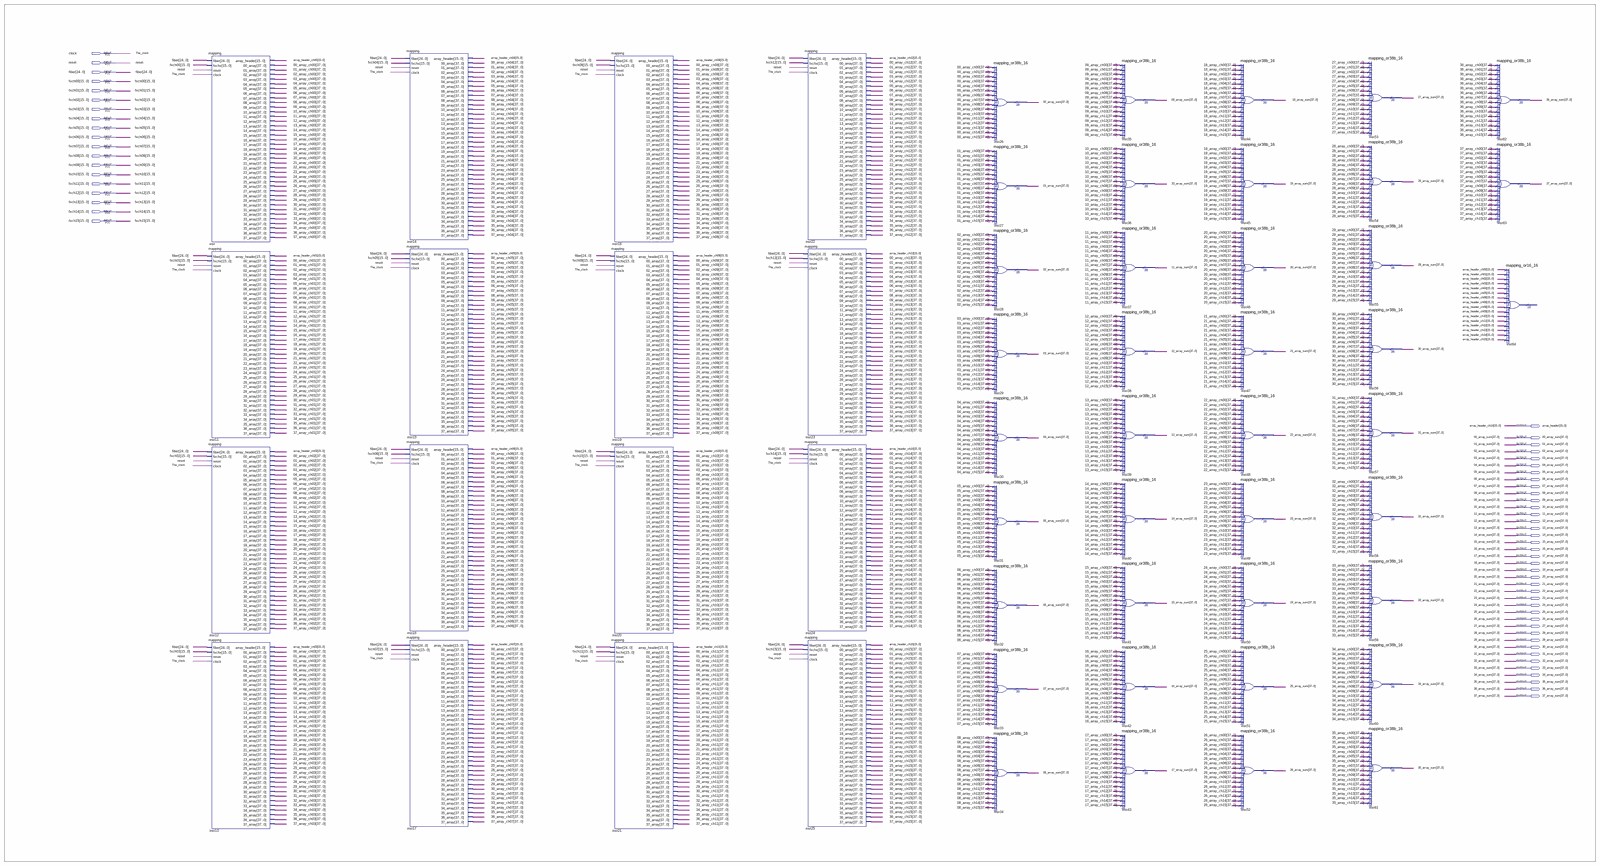
[diagram p0: schematic sheet, whole]
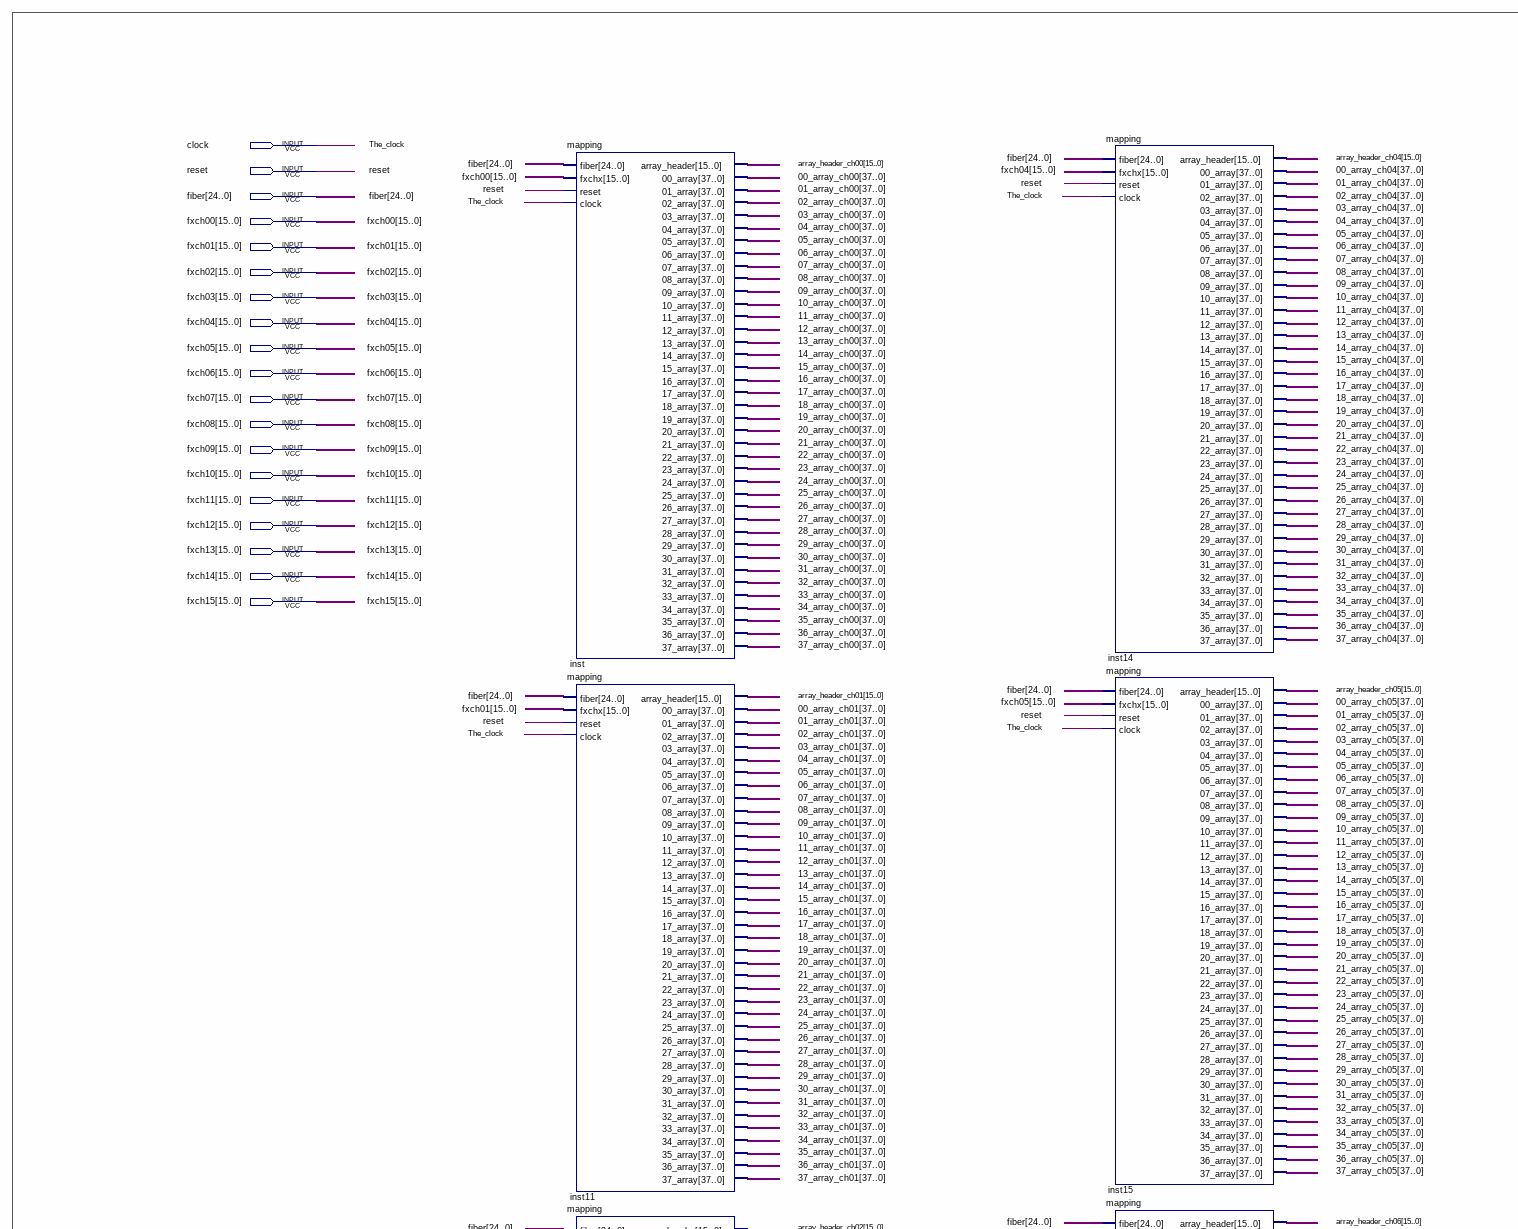
[diagram p1: schematic sheet, upper left part]
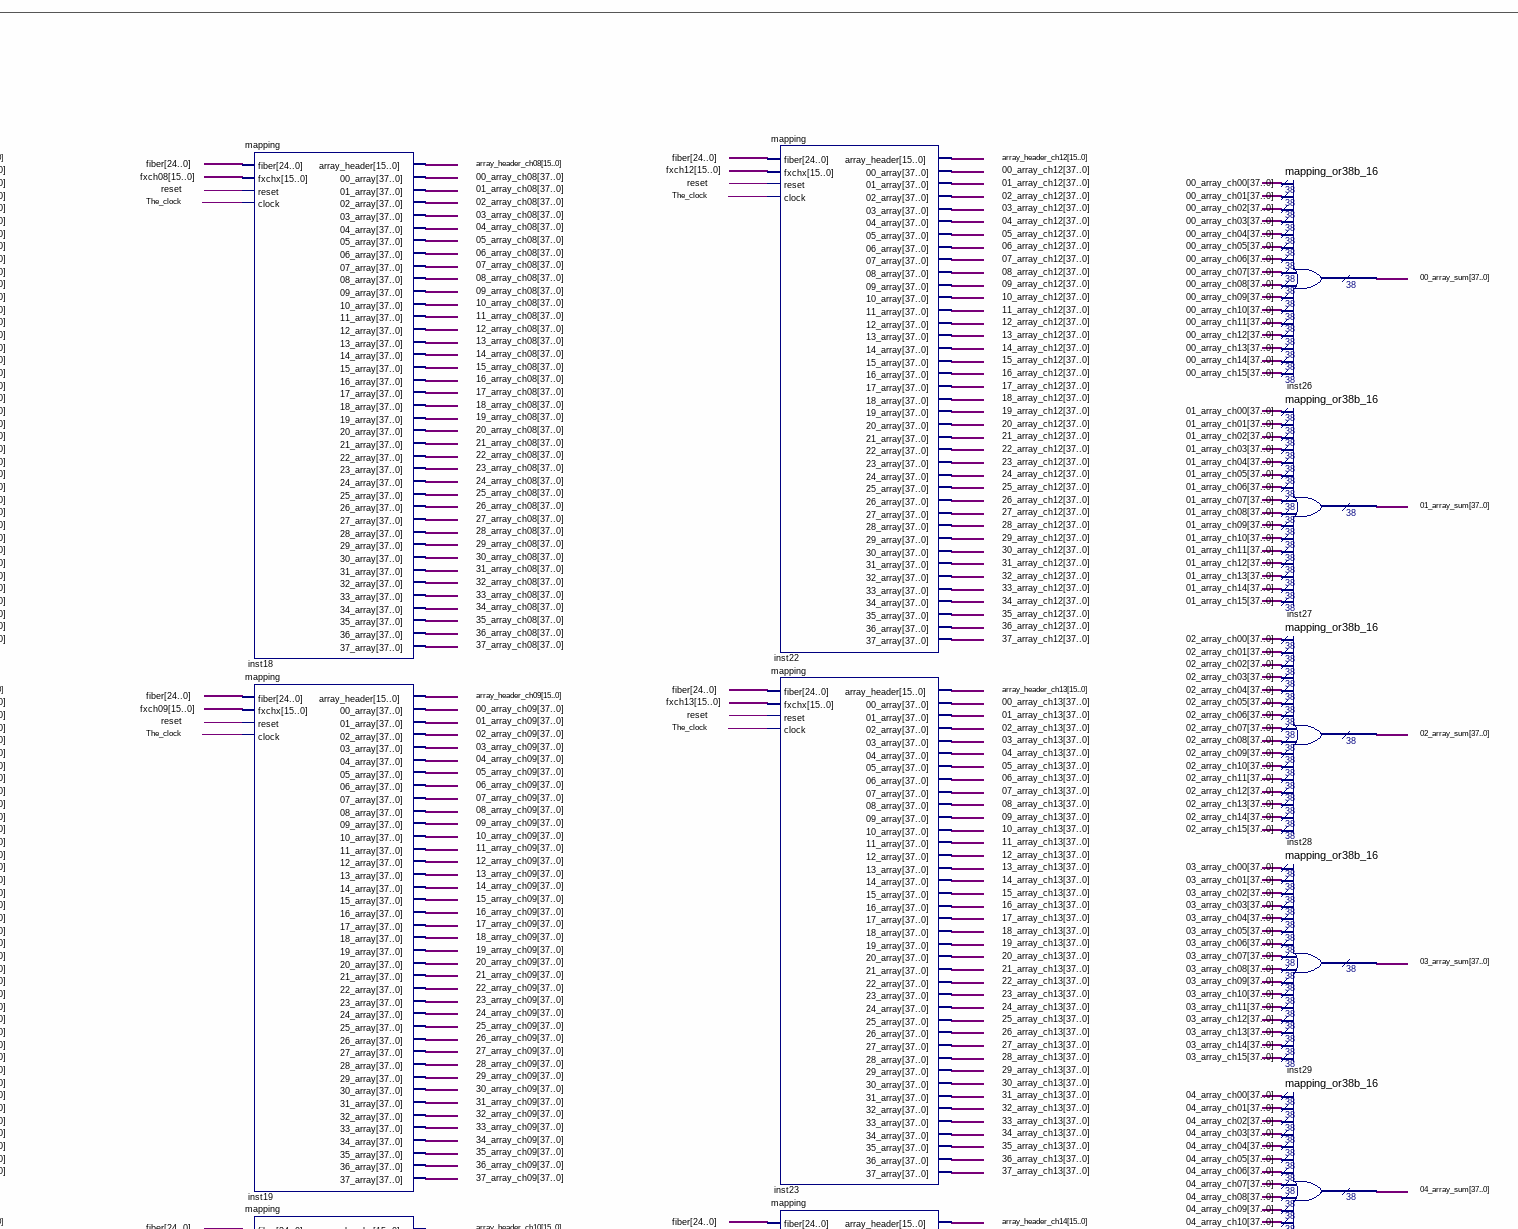
[diagram p2: schematic sheet, upper centre part]
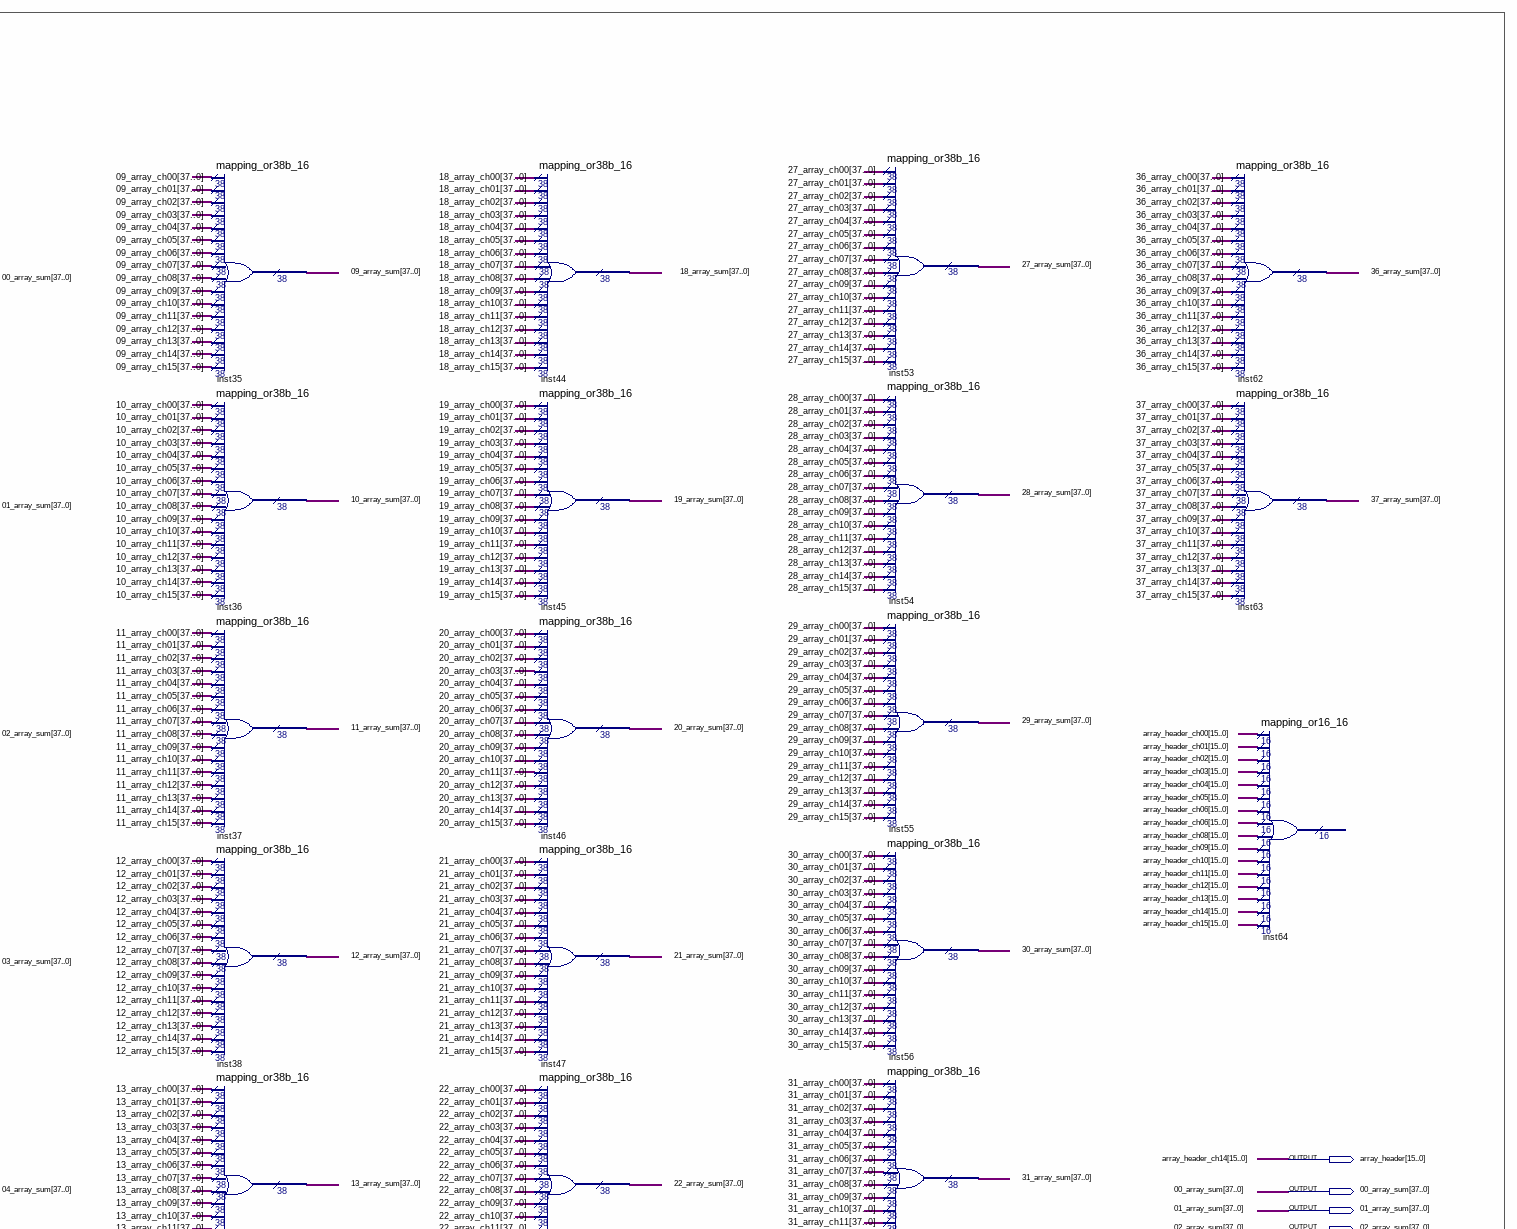
[diagram p3: schematic sheet, upper right part]
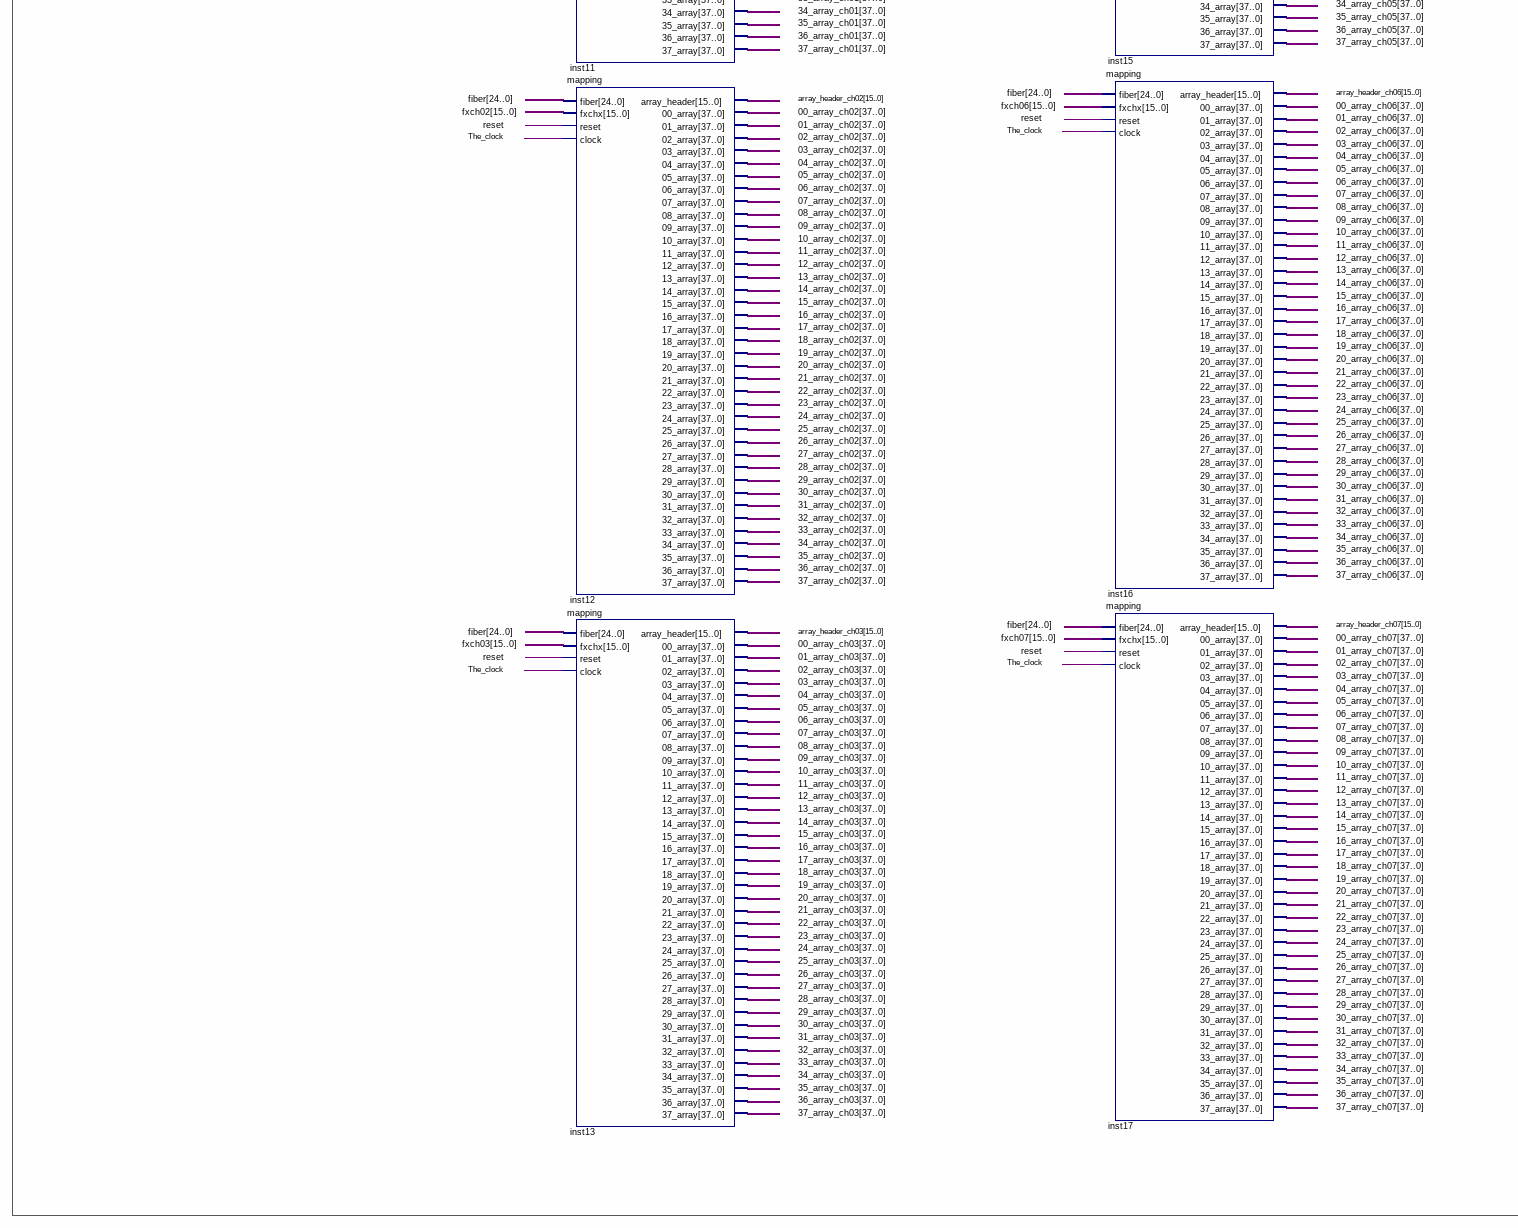
[diagram p4: schematic sheet, lower left part]
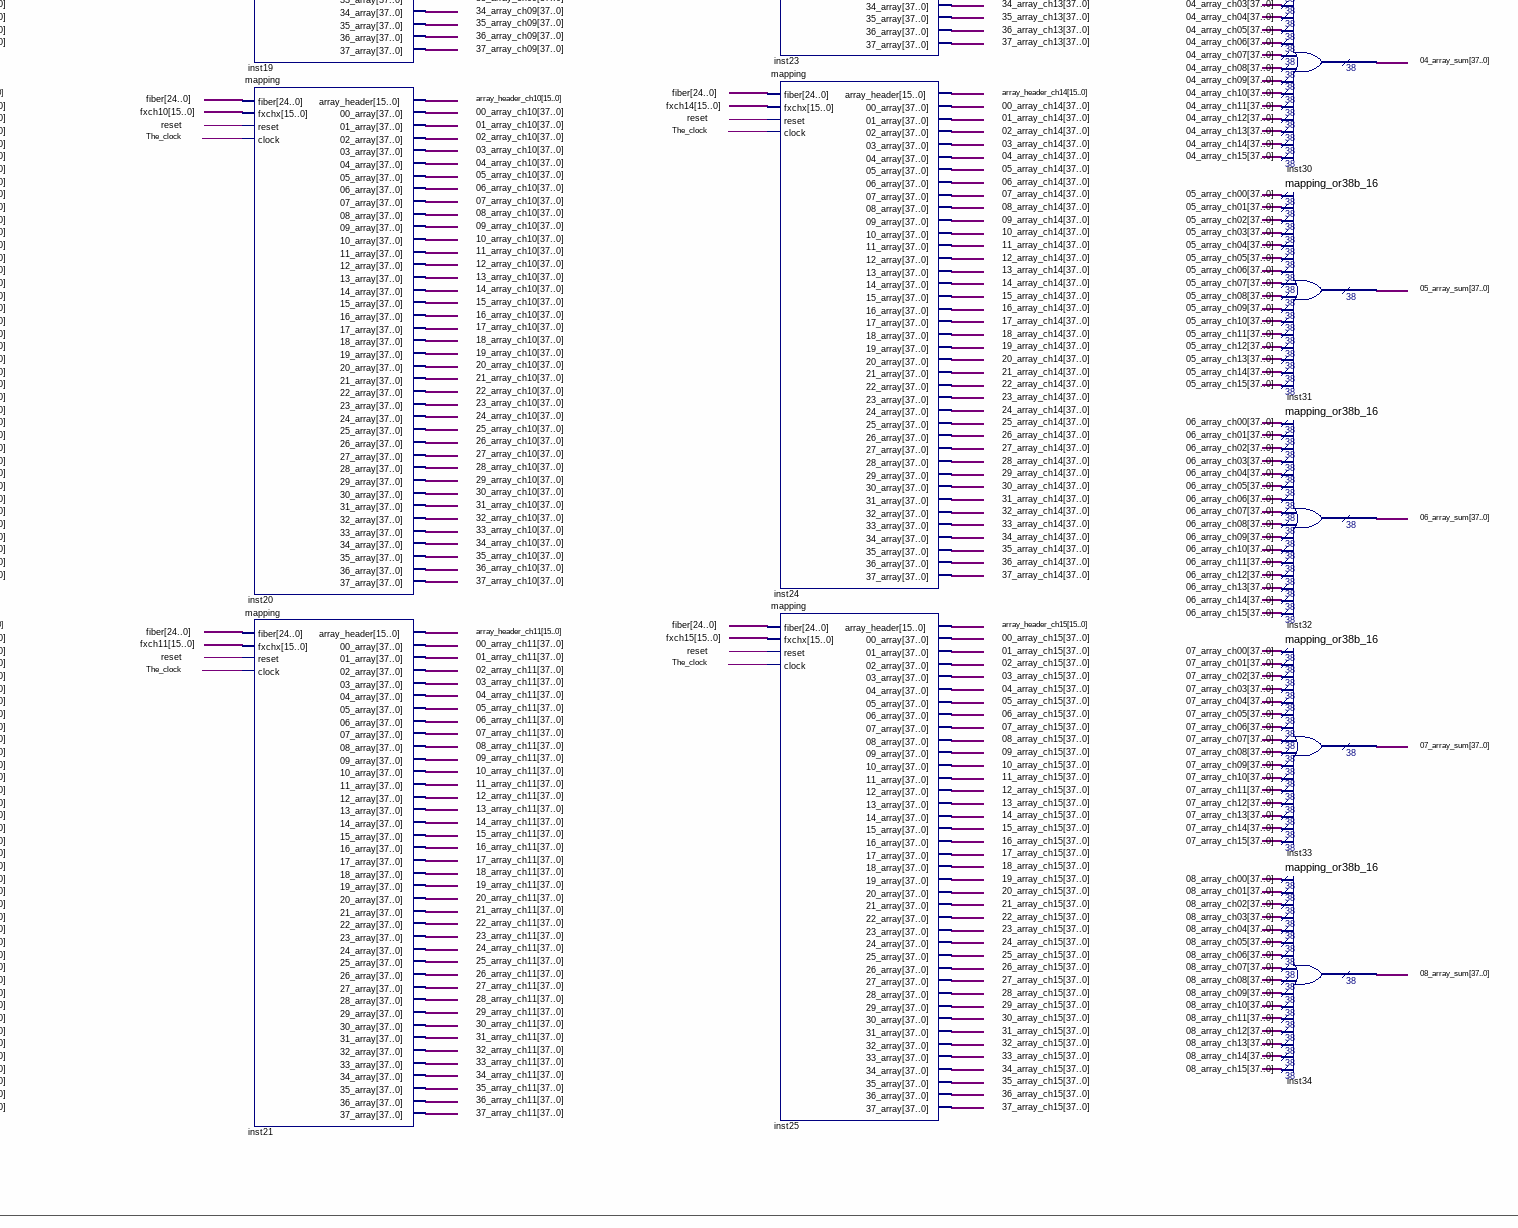
[diagram p5: schematic sheet, lower centre part]
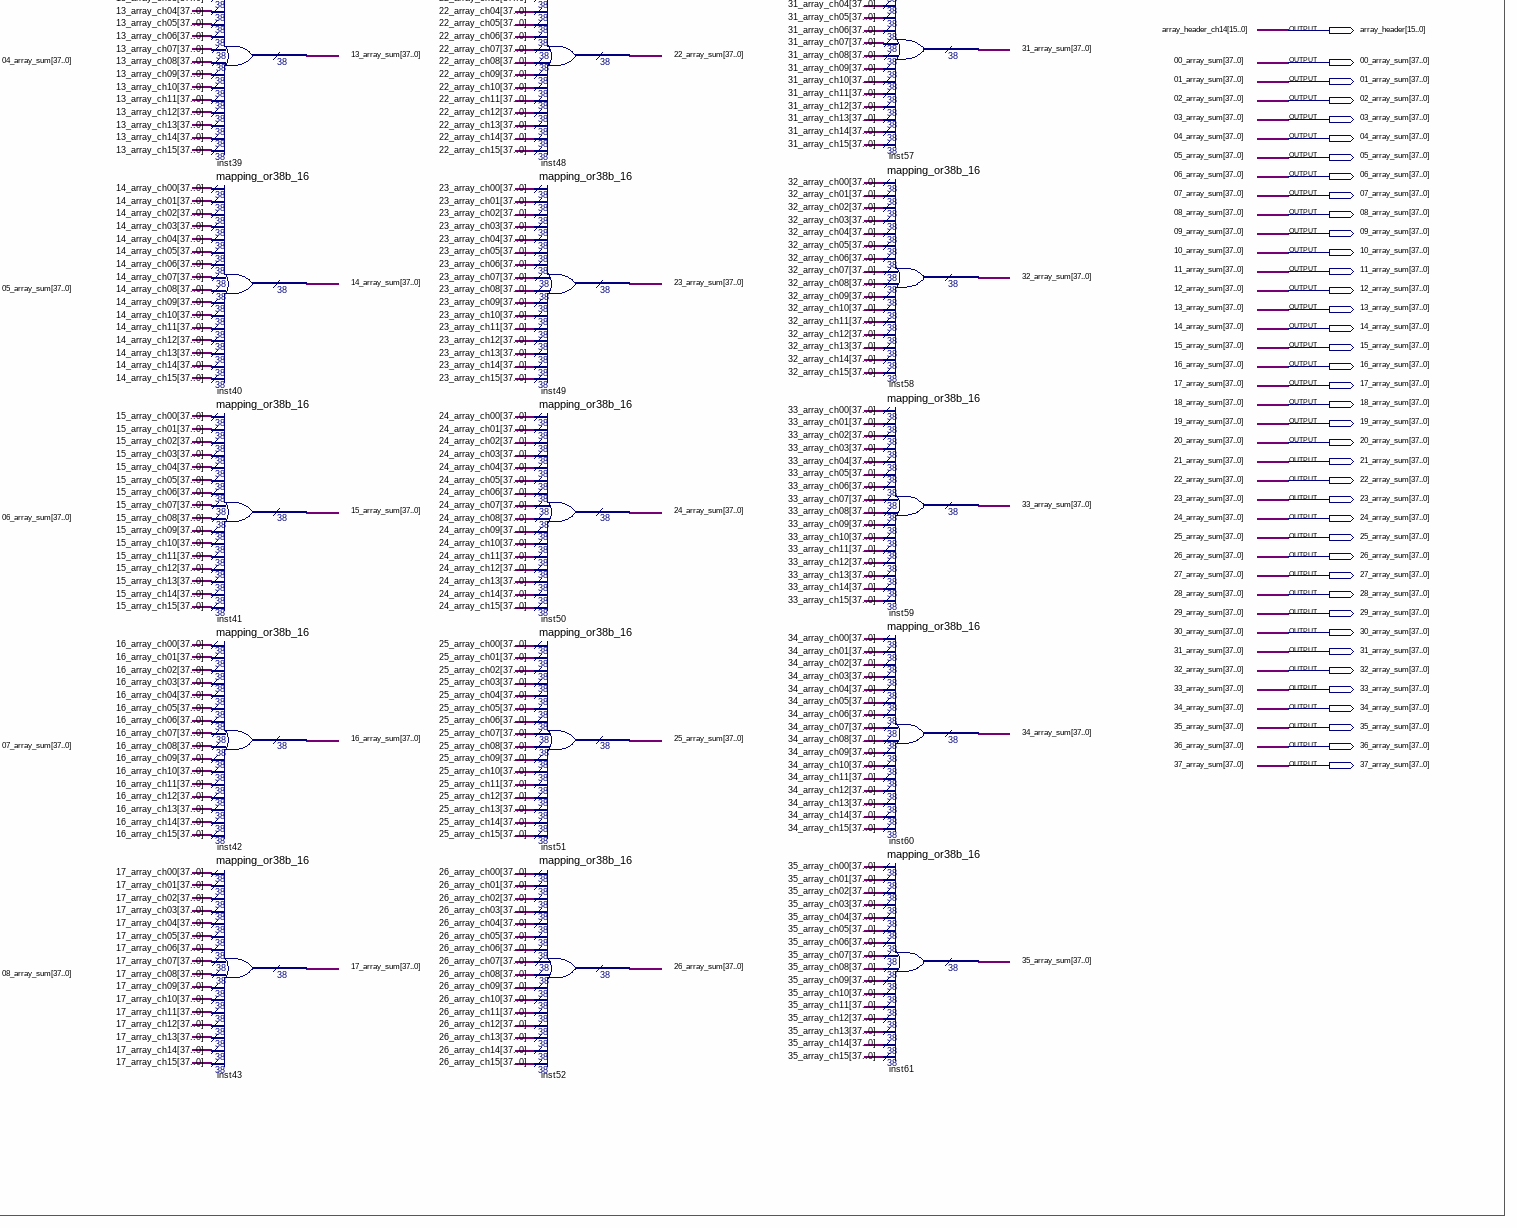
[diagram p6: schematic sheet, lower right part]
// Quartus schematic mapping_top.bdf as structural Verilog: 55 symbols, 58 pins
module mapping_top (
  input  clock,
  input  reset,
  input  [24:0] fiber,
  input  [15:0] fxch00,
  input  [15:0] fxch01,
  input  [15:0] fxch02,
  input  [15:0] fxch03,
  input  [15:0] fxch04,
  input  [15:0] fxch05,
  input  [15:0] fxch06,
  input  [15:0] fxch07,
  input  [15:0] fxch08,
  input  [15:0] fxch09,
  input  [15:0] fxch10,
  input  [15:0] fxch11,
  input  [15:0] fxch12,
  input  [15:0] fxch13,
  input  [15:0] fxch14,
  input  [15:0] fxch15,
  output [15:0] array_header,
  output [37:0] \00_array_sum ,
  output [37:0] \01_array_sum ,
  output [37:0] \02_array_sum ,
  output [37:0] \03_array_sum ,
  output [37:0] \04_array_sum ,
  output [37:0] \05_array_sum ,
  output [37:0] \06_array_sum ,
  output [37:0] \07_array_sum ,
  output [37:0] \08_array_sum ,
  output [37:0] \09_array_sum ,
  output [37:0] \10_array_sum ,
  output [37:0] \11_array_sum ,
  output [37:0] \12_array_sum ,
  output [37:0] \13_array_sum ,
  output [37:0] \14_array_sum ,
  output [37:0] \15_array_sum ,
  output [37:0] \16_array_sum ,
  output [37:0] \17_array_sum ,
  output [37:0] \18_array_sum ,
  output [37:0] \19_array_sum ,
  output [37:0] \20_array_sum ,
  output [37:0] \21_array_sum ,
  output [37:0] \22_array_sum ,
  output [37:0] \23_array_sum ,
  output [37:0] \24_array_sum ,
  output [37:0] \25_array_sum ,
  output [37:0] \26_array_sum ,
  output [37:0] \27_array_sum ,
  output [37:0] \28_array_sum ,
  output [37:0] \29_array_sum ,
  output [37:0] \30_array_sum ,
  output [37:0] \31_array_sum ,
  output [37:0] \32_array_sum ,
  output [37:0] \33_array_sum ,
  output [37:0] \34_array_sum ,
  output [37:0] \35_array_sum ,
  output [37:0] \36_array_sum ,
  output [37:0] \37_array_sum 
);

  wire [15:0] array_header_ch00, array_header_ch01, array_header_ch02, array_header_ch03, array_header_ch04,
       array_header_ch05, array_header_ch06, array_header_ch07, array_header_ch08, array_header_ch09,
       array_header_ch10, array_header_ch11, array_header_ch12, array_header_ch13, array_header_ch15;
  wire [37:0] \00_array_ch00 , \00_array_ch01 , \00_array_ch02 , \00_array_ch03 , \00_array_ch04 ,
       \00_array_ch05 , \00_array_ch06 , \00_array_ch07 , \00_array_ch08 , \00_array_ch09 , \00_array_ch10 ,
       \00_array_ch11 , \00_array_ch12 , \00_array_ch13 , \00_array_ch14 , \00_array_ch15 , \01_array_ch00 ,
       \01_array_ch01 , \01_array_ch02 , \01_array_ch03 , \01_array_ch04 , \01_array_ch05 , \01_array_ch06 ,
       \01_array_ch07 , \01_array_ch08 , \01_array_ch09 , \01_array_ch10 , \01_array_ch11 , \01_array_ch12 ,
       \01_array_ch13 , \01_array_ch14 , \01_array_ch15 , \02_array_ch00 , \02_array_ch01 , \02_array_ch02 ,
       \02_array_ch03 , \02_array_ch04 , \02_array_ch05 , \02_array_ch06 , \02_array_ch07 , \02_array_ch08 ,
       \02_array_ch09 , \02_array_ch10 , \02_array_ch11 , \02_array_ch12 , \02_array_ch13 , \02_array_ch14 ,
       \02_array_ch15 , \03_array_ch00 , \03_array_ch01 , \03_array_ch02 , \03_array_ch03 , \03_array_ch04 ,
       \03_array_ch05 , \03_array_ch06 , \03_array_ch07 , \03_array_ch08 , \03_array_ch09 , \03_array_ch10 ,
       \03_array_ch11 , \03_array_ch12 , \03_array_ch13 , \03_array_ch14 , \03_array_ch15 , \04_array_ch00 ,
       \04_array_ch01 , \04_array_ch02 , \04_array_ch03 , \04_array_ch04 , \04_array_ch05 , \04_array_ch06 ,
       \04_array_ch07 , \04_array_ch08 , \04_array_ch09 , \04_array_ch10 , \04_array_ch11 , \04_array_ch12 ,
       \04_array_ch13 , \04_array_ch14 , \04_array_ch15 , \05_array_ch00 , \05_array_ch01 , \05_array_ch02 ,
       \05_array_ch03 , \05_array_ch04 , \05_array_ch05 , \05_array_ch06 , \05_array_ch07 , \05_array_ch08 ,
       \05_array_ch09 , \05_array_ch10 , \05_array_ch11 , \05_array_ch12 , \05_array_ch13 , \05_array_ch14 ,
       \05_array_ch15 , \06_array_ch00 , \06_array_ch01 , \06_array_ch02 , \06_array_ch03 , \06_array_ch04 ,
       \06_array_ch05 , \06_array_ch06 , \06_array_ch07 , \06_array_ch08 , \06_array_ch09 , \06_array_ch10 ,
       \06_array_ch11 , \06_array_ch12 , \06_array_ch13 , \06_array_ch14 , \06_array_ch15 , \07_array_ch00 ,
       \07_array_ch01 , \07_array_ch02 , \07_array_ch03 , \07_array_ch04 , \07_array_ch05 , \07_array_ch06 ,
       \07_array_ch07 , \07_array_ch08 , \07_array_ch09 , \07_array_ch10 , \07_array_ch11 , \07_array_ch12 ,
       \07_array_ch13 , \07_array_ch14 , \07_array_ch15 , \08_array_ch00 , \08_array_ch01 , \08_array_ch02 ,
       \08_array_ch03 , \08_array_ch04 , \08_array_ch05 , \08_array_ch06 , \08_array_ch07 , \08_array_ch08 ,
       \08_array_ch09 , \08_array_ch10 , \08_array_ch11 , \08_array_ch12 , \08_array_ch13 , \08_array_ch14 ,
       \08_array_ch15 , \09_array_ch00 , \09_array_ch01 , \09_array_ch02 , \09_array_ch03 , \09_array_ch04 ,
       \09_array_ch05 , \09_array_ch06 , \09_array_ch07 , \09_array_ch08 , \09_array_ch09 , \09_array_ch10 ,
       \09_array_ch11 , \09_array_ch12 , \09_array_ch13 , \09_array_ch14 , \09_array_ch15 , \10_array_ch00 ,
       \10_array_ch01 , \10_array_ch02 , \10_array_ch03 , \10_array_ch04 , \10_array_ch05 , \10_array_ch06 ,
       \10_array_ch07 , \10_array_ch08 , \10_array_ch09 , \10_array_ch10 , \10_array_ch11 , \10_array_ch12 ,
       \10_array_ch13 , \10_array_ch14 , \10_array_ch15 , \11_array_ch00 , \11_array_ch01 , \11_array_ch02 ,
       \11_array_ch03 , \11_array_ch04 , \11_array_ch05 , \11_array_ch06 , \11_array_ch07 , \11_array_ch08 ,
       \11_array_ch09 , \11_array_ch10 , \11_array_ch11 , \11_array_ch12 , \11_array_ch13 , \11_array_ch14 ,
       \11_array_ch15 , \12_array_ch00 , \12_array_ch01 , \12_array_ch02 , \12_array_ch03 , \12_array_ch04 ,
       \12_array_ch05 , \12_array_ch06 , \12_array_ch07 , \12_array_ch08 , \12_array_ch09 , \12_array_ch10 ,
       \12_array_ch11 , \12_array_ch12 , \12_array_ch13 , \12_array_ch14 , \12_array_ch15 , \13_array_ch00 ,
       \13_array_ch01 , \13_array_ch02 , \13_array_ch03 , \13_array_ch04 , \13_array_ch05 , \13_array_ch06 ,
       \13_array_ch07 , \13_array_ch08 , \13_array_ch09 , \13_array_ch10 , \13_array_ch11 , \13_array_ch12 ,
       \13_array_ch13 , \13_array_ch14 , \13_array_ch15 , \14_array_ch00 , \14_array_ch01 , \14_array_ch02 ,
       \14_array_ch03 , \14_array_ch04 , \14_array_ch05 , \14_array_ch06 , \14_array_ch07 , \14_array_ch08 ,
       \14_array_ch09 , \14_array_ch10 , \14_array_ch11 , \14_array_ch12 , \14_array_ch13 , \14_array_ch14 ,
       \14_array_ch15 , \15_array_ch00 , \15_array_ch01 , \15_array_ch02 , \15_array_ch03 , \15_array_ch04 ,
       \15_array_ch05 , \15_array_ch06 , \15_array_ch07 , \15_array_ch08 , \15_array_ch09 , \15_array_ch10 ,
       \15_array_ch11 , \15_array_ch12 , \15_array_ch13 , \15_array_ch14 , \15_array_ch15 , \16_array_ch00 ,
       \16_array_ch01 , \16_array_ch02 , \16_array_ch03 , \16_array_ch04 , \16_array_ch05 , \16_array_ch06 ,
       \16_array_ch07 , \16_array_ch08 , \16_array_ch09 , \16_array_ch10 , \16_array_ch11 , \16_array_ch12 ,
       \16_array_ch13 , \16_array_ch14 , \16_array_ch15 , \17_array_ch00 , \17_array_ch01 , \17_array_ch02 ,
       \17_array_ch03 , \17_array_ch04 , \17_array_ch05 , \17_array_ch06 , \17_array_ch07 , \17_array_ch08 ,
       \17_array_ch09 , \17_array_ch10 , \17_array_ch11 , \17_array_ch12 , \17_array_ch13 , \17_array_ch14 ,
       \17_array_ch15 , \18_array_ch00 , \18_array_ch01 , \18_array_ch02 , \18_array_ch03 , \18_array_ch04 ,
       \18_array_ch05 , \18_array_ch06 , \18_array_ch07 , \18_array_ch08 , \18_array_ch09 , \18_array_ch10 ,
       \18_array_ch11 , \18_array_ch12 , \18_array_ch13 , \18_array_ch14 , \18_array_ch15 , \19_array_ch00 ,
       \19_array_ch01 , \19_array_ch02 , \19_array_ch03 , \19_array_ch04 , \19_array_ch05 , \19_array_ch06 ,
       \19_array_ch07 , \19_array_ch08 , \19_array_ch09 , \19_array_ch10 , \19_array_ch11 , \19_array_ch12 ,
       \19_array_ch13 , \19_array_ch14 , \19_array_ch15 , \20_array_ch00 , \20_array_ch01 , \20_array_ch02 ,
       \20_array_ch03 , \20_array_ch04 , \20_array_ch05 , \20_array_ch06 , \20_array_ch07 , \20_array_ch08 ,
       \20_array_ch09 , \20_array_ch10 , \20_array_ch11 , \20_array_ch12 , \20_array_ch13 , \20_array_ch14 ,
       \20_array_ch15 , \21_array_ch00 , \21_array_ch01 , \21_array_ch02 , \21_array_ch03 , \21_array_ch04 ,
       \21_array_ch05 , \21_array_ch06 , \21_array_ch07 , \21_array_ch08 , \21_array_ch09 , \21_array_ch10 ,
       \21_array_ch11 , \21_array_ch12 , \21_array_ch13 , \21_array_ch14 , \21_array_ch15 , \22_array_ch00 ,
       \22_array_ch01 , \22_array_ch02 , \22_array_ch03 , \22_array_ch04 , \22_array_ch05 , \22_array_ch06 ,
       \22_array_ch07 , \22_array_ch08 , \22_array_ch09 , \22_array_ch10 , \22_array_ch11 , \22_array_ch12 ,
       \22_array_ch13 , \22_array_ch14 , \22_array_ch15 , \23_array_ch00 , \23_array_ch01 , \23_array_ch02 ,
       \23_array_ch03 , \23_array_ch04 , \23_array_ch05 , \23_array_ch06 , \23_array_ch07 , \23_array_ch08 ,
       \23_array_ch09 , \23_array_ch10 , \23_array_ch11 , \23_array_ch12 , \23_array_ch13 , \23_array_ch14 ,
       \23_array_ch15 , \24_array_ch00 , \24_array_ch01 , \24_array_ch02 , \24_array_ch03 , \24_array_ch04 ,
       \24_array_ch05 , \24_array_ch06 , \24_array_ch07 , \24_array_ch08 , \24_array_ch09 , \24_array_ch10 ,
       \24_array_ch11 , \24_array_ch12 , \24_array_ch13 , \24_array_ch14 , \24_array_ch15 , \25_array_ch00 ,
       \25_array_ch01 , \25_array_ch02 , \25_array_ch03 , \25_array_ch04 , \25_array_ch05 , \25_array_ch06 ,
       \25_array_ch07 , \25_array_ch08 , \25_array_ch09 , \25_array_ch10 , \25_array_ch11 , \25_array_ch12 ,
       \25_array_ch13 , \25_array_ch14 , \25_array_ch15 , \26_array_ch00 , \26_array_ch01 , \26_array_ch02 ,
       \26_array_ch03 , \26_array_ch04 , \26_array_ch05 , \26_array_ch06 , \26_array_ch07 , \26_array_ch08 ,
       \26_array_ch09 , \26_array_ch10 , \26_array_ch11 , \26_array_ch12 , \26_array_ch13 , \26_array_ch14 ,
       \26_array_ch15 , \27_array_ch00 , \27_array_ch01 , \27_array_ch02 , \27_array_ch03 , \27_array_ch04 ,
       \27_array_ch05 , \27_array_ch06 , \27_array_ch07 , \27_array_ch08 , \27_array_ch09 , \27_array_ch10 ,
       \27_array_ch11 , \27_array_ch12 , \27_array_ch13 , \27_array_ch14 , \27_array_ch15 , \28_array_ch00 ,
       \28_array_ch01 , \28_array_ch02 , \28_array_ch03 , \28_array_ch04 , \28_array_ch05 , \28_array_ch06 ,
       \28_array_ch07 , \28_array_ch08 , \28_array_ch09 , \28_array_ch10 , \28_array_ch11 , \28_array_ch12 ,
       \28_array_ch13 , \28_array_ch14 , \28_array_ch15 , \29_array_ch00 , \29_array_ch01 , \29_array_ch02 ,
       \29_array_ch03 , \29_array_ch04 , \29_array_ch05 , \29_array_ch06 , \29_array_ch07 , \29_array_ch08 ,
       \29_array_ch09 , \29_array_ch10 , \29_array_ch11 , \29_array_ch12 , \29_array_ch13 , \29_array_ch14 ,
       \29_array_ch15 , \30_array_ch00 , \30_array_ch01 , \30_array_ch02 , \30_array_ch03 , \30_array_ch04 ,
       \30_array_ch05 , \30_array_ch06 , \30_array_ch07 , \30_array_ch08 , \30_array_ch09 , \30_array_ch10 ,
       \30_array_ch11 , \30_array_ch12 , \30_array_ch13 , \30_array_ch14 , \30_array_ch15 , \31_array_ch00 ,
       \31_array_ch01 , \31_array_ch02 , \31_array_ch03 , \31_array_ch04 , \31_array_ch05 , \31_array_ch06 ,
       \31_array_ch07 , \31_array_ch08 , \31_array_ch09 , \31_array_ch10 , \31_array_ch11 , \31_array_ch12 ,
       \31_array_ch13 , \31_array_ch14 , \31_array_ch15 , \32_array_ch00 , \32_array_ch01 , \32_array_ch02 ,
       \32_array_ch03 , \32_array_ch04 , \32_array_ch05 , \32_array_ch06 , \32_array_ch07 , \32_array_ch08 ,
       \32_array_ch09 , \32_array_ch10 , \32_array_ch11 , \32_array_ch12 , \32_array_ch13 , \32_array_ch14 ,
       \32_array_ch15 , \33_array_ch00 , \33_array_ch01 , \33_array_ch02 , \33_array_ch03 , \33_array_ch04 ,
       \33_array_ch05 , \33_array_ch06 , \33_array_ch07 , \33_array_ch08 , \33_array_ch09 , \33_array_ch10 ,
       \33_array_ch11 , \33_array_ch12 , \33_array_ch13 , \33_array_ch14 , \33_array_ch15 , \34_array_ch00 ,
       \34_array_ch01 , \34_array_ch02 , \34_array_ch03 , \34_array_ch04 , \34_array_ch05 , \34_array_ch06 ,
       \34_array_ch07 , \34_array_ch08 , \34_array_ch09 , \34_array_ch10 , \34_array_ch11 , \34_array_ch12 ,
       \34_array_ch13 , \34_array_ch14 , \34_array_ch15 , \35_array_ch00 , \35_array_ch01 , \35_array_ch02 ,
       \35_array_ch03 , \35_array_ch04 , \35_array_ch05 , \35_array_ch06 , \35_array_ch07 , \35_array_ch08 ,
       \35_array_ch09 , \35_array_ch10 , \35_array_ch11 , \35_array_ch12 , \35_array_ch13 , \35_array_ch14 ,
       \35_array_ch15 , \36_array_ch00 , \36_array_ch01 , \36_array_ch02 , \36_array_ch03 , \36_array_ch04 ,
       \36_array_ch05 , \36_array_ch06 , \36_array_ch07 , \36_array_ch08 , \36_array_ch09 , \36_array_ch10 ,
       \36_array_ch11 , \36_array_ch12 , \36_array_ch13 , \36_array_ch14 , \36_array_ch15 , \37_array_ch00 ,
       \37_array_ch01 , \37_array_ch02 , \37_array_ch03 , \37_array_ch04 , \37_array_ch05 , \37_array_ch06 ,
       \37_array_ch07 , \37_array_ch08 , \37_array_ch09 , \37_array_ch10 , \37_array_ch11 , \37_array_ch12 ,
       \37_array_ch13 , \37_array_ch14 , \37_array_ch15 ;

  mapping inst (
    .fiber(fiber), .fxchx(fxch00), .reset(reset), .clock(clock), .array_header(array_header_ch00),
    .\00_array (\00_array_ch00 ), .\01_array (\01_array_ch00 ), .\02_array (\02_array_ch00 ),
    .\03_array (\03_array_ch00 ), .\04_array (\04_array_ch00 ), .\05_array (\05_array_ch00 ),
    .\06_array (\06_array_ch00 ), .\07_array (\07_array_ch00 ), .\08_array (\08_array_ch00 ),
    .\09_array (\09_array_ch00 ), .\10_array (\10_array_ch00 ), .\11_array (\11_array_ch00 ),
    .\12_array (\12_array_ch00 ), .\13_array (\13_array_ch00 ), .\14_array (\14_array_ch00 ),
    .\15_array (\15_array_ch00 ), .\16_array (\16_array_ch00 ), .\17_array (\17_array_ch00 ),
    .\18_array (\18_array_ch00 ), .\19_array (\19_array_ch00 ), .\20_array (\20_array_ch00 ),
    .\21_array (\21_array_ch00 ), .\22_array (\22_array_ch00 ), .\23_array (\23_array_ch00 ),
    .\24_array (\24_array_ch00 ), .\25_array (\25_array_ch00 ), .\26_array (\26_array_ch00 ),
    .\27_array (\27_array_ch00 ), .\28_array (\28_array_ch00 ), .\29_array (\29_array_ch00 ),
    .\30_array (\30_array_ch00 ), .\31_array (\31_array_ch00 ), .\32_array (\32_array_ch00 ),
    .\33_array (\33_array_ch00 ), .\34_array (\34_array_ch00 ), .\35_array (\35_array_ch00 ),
    .\36_array (\36_array_ch00 ), .\37_array (\37_array_ch00 ));
  mapping inst11 (
    .fiber(fiber), .fxchx(fxch01), .reset(reset), .clock(clock), .array_header(array_header_ch01),
    .\00_array (\00_array_ch01 ), .\01_array (\01_array_ch01 ), .\02_array (\02_array_ch01 ),
    .\03_array (\03_array_ch01 ), .\04_array (\04_array_ch01 ), .\05_array (\05_array_ch01 ),
    .\06_array (\06_array_ch01 ), .\07_array (\07_array_ch01 ), .\08_array (\08_array_ch01 ),
    .\09_array (\09_array_ch01 ), .\10_array (\10_array_ch01 ), .\11_array (\11_array_ch01 ),
    .\12_array (\12_array_ch01 ), .\13_array (\13_array_ch01 ), .\14_array (\14_array_ch01 ),
    .\15_array (\15_array_ch01 ), .\16_array (\16_array_ch01 ), .\17_array (\17_array_ch01 ),
    .\18_array (\18_array_ch01 ), .\19_array (\19_array_ch01 ), .\20_array (\20_array_ch01 ),
    .\21_array (\21_array_ch01 ), .\22_array (\22_array_ch01 ), .\23_array (\23_array_ch01 ),
    .\24_array (\24_array_ch01 ), .\25_array (\25_array_ch01 ), .\26_array (\26_array_ch01 ),
    .\27_array (\27_array_ch01 ), .\28_array (\28_array_ch01 ), .\29_array (\29_array_ch01 ),
    .\30_array (\30_array_ch01 ), .\31_array (\31_array_ch01 ), .\32_array (\32_array_ch01 ),
    .\33_array (\33_array_ch01 ), .\34_array (\34_array_ch01 ), .\35_array (\35_array_ch01 ),
    .\36_array (\36_array_ch01 ), .\37_array (\37_array_ch01 ));
  mapping inst12 (
    .fiber(fiber), .fxchx(fxch02), .reset(reset), .clock(clock), .array_header(array_header_ch02),
    .\00_array (\00_array_ch02 ), .\01_array (\01_array_ch02 ), .\02_array (\02_array_ch02 ),
    .\03_array (\03_array_ch02 ), .\04_array (\04_array_ch02 ), .\05_array (\05_array_ch02 ),
    .\06_array (\06_array_ch02 ), .\07_array (\07_array_ch02 ), .\08_array (\08_array_ch02 ),
    .\09_array (\09_array_ch02 ), .\10_array (\10_array_ch02 ), .\11_array (\11_array_ch02 ),
    .\12_array (\12_array_ch02 ), .\13_array (\13_array_ch02 ), .\14_array (\14_array_ch02 ),
    .\15_array (\15_array_ch02 ), .\16_array (\16_array_ch02 ), .\17_array (\17_array_ch02 ),
    .\18_array (\18_array_ch02 ), .\19_array (\19_array_ch02 ), .\20_array (\20_array_ch02 ),
    .\21_array (\21_array_ch02 ), .\22_array (\22_array_ch02 ), .\23_array (\23_array_ch02 ),
    .\24_array (\24_array_ch02 ), .\25_array (\25_array_ch02 ), .\26_array (\26_array_ch02 ),
    .\27_array (\27_array_ch02 ), .\28_array (\28_array_ch02 ), .\29_array (\29_array_ch02 ),
    .\30_array (\30_array_ch02 ), .\31_array (\31_array_ch02 ), .\32_array (\32_array_ch02 ),
    .\33_array (\33_array_ch02 ), .\34_array (\34_array_ch02 ), .\35_array (\35_array_ch02 ),
    .\36_array (\36_array_ch02 ), .\37_array (\37_array_ch02 ));
  mapping inst13 (
    .fiber(fiber), .fxchx(fxch03), .reset(reset), .clock(clock), .array_header(array_header_ch03),
    .\00_array (\00_array_ch03 ), .\01_array (\01_array_ch03 ), .\02_array (\02_array_ch03 ),
    .\03_array (\03_array_ch03 ), .\04_array (\04_array_ch03 ), .\05_array (\05_array_ch03 ),
    .\06_array (\06_array_ch03 ), .\07_array (\07_array_ch03 ), .\08_array (\08_array_ch03 ),
    .\09_array (\09_array_ch03 ), .\10_array (\10_array_ch03 ), .\11_array (\11_array_ch03 ),
    .\12_array (\12_array_ch03 ), .\13_array (\13_array_ch03 ), .\14_array (\14_array_ch03 ),
    .\15_array (\15_array_ch03 ), .\16_array (\16_array_ch03 ), .\17_array (\17_array_ch03 ),
    .\18_array (\18_array_ch03 ), .\19_array (\19_array_ch03 ), .\20_array (\20_array_ch03 ),
    .\21_array (\21_array_ch03 ), .\22_array (\22_array_ch03 ), .\23_array (\23_array_ch03 ),
    .\24_array (\24_array_ch03 ), .\25_array (\25_array_ch03 ), .\26_array (\26_array_ch03 ),
    .\27_array (\27_array_ch03 ), .\28_array (\28_array_ch03 ), .\29_array (\29_array_ch03 ),
    .\30_array (\30_array_ch03 ), .\31_array (\31_array_ch03 ), .\32_array (\32_array_ch03 ),
    .\33_array (\33_array_ch03 ), .\34_array (\34_array_ch03 ), .\35_array (\35_array_ch03 ),
    .\36_array (\36_array_ch03 ), .\37_array (\37_array_ch03 ));
  mapping inst14 (
    .fiber(fiber), .fxchx(fxch04), .reset(reset), .clock(clock), .array_header(array_header_ch04),
    .\00_array (\00_array_ch04 ), .\01_array (\01_array_ch04 ), .\02_array (\02_array_ch04 ),
    .\03_array (\03_array_ch04 ), .\04_array (\04_array_ch04 ), .\05_array (\05_array_ch04 ),
    .\06_array (\06_array_ch04 ), .\07_array (\07_array_ch04 ), .\08_array (\08_array_ch04 ),
    .\09_array (\09_array_ch04 ), .\10_array (\10_array_ch04 ), .\11_array (\11_array_ch04 ),
    .\12_array (\12_array_ch04 ), .\13_array (\13_array_ch04 ), .\14_array (\14_array_ch04 ),
    .\15_array (\15_array_ch04 ), .\16_array (\16_array_ch04 ), .\17_array (\17_array_ch04 ),
    .\18_array (\18_array_ch04 ), .\19_array (\19_array_ch04 ), .\20_array (\20_array_ch04 ),
    .\21_array (\21_array_ch04 ), .\22_array (\22_array_ch04 ), .\23_array (\23_array_ch04 ),
    .\24_array (\24_array_ch04 ), .\25_array (\25_array_ch04 ), .\26_array (\26_array_ch04 ),
    .\27_array (\27_array_ch04 ), .\28_array (\28_array_ch04 ), .\29_array (\29_array_ch04 ),
    .\30_array (\30_array_ch04 ), .\31_array (\31_array_ch04 ), .\32_array (\32_array_ch04 ),
    .\33_array (\33_array_ch04 ), .\34_array (\34_array_ch04 ), .\35_array (\35_array_ch04 ),
    .\36_array (\36_array_ch04 ), .\37_array (\37_array_ch04 ));
  mapping inst15 (
    .fiber(fiber), .fxchx(fxch05), .reset(reset), .clock(clock), .array_header(array_header_ch05),
    .\00_array (\00_array_ch05 ), .\01_array (\01_array_ch05 ), .\02_array (\02_array_ch05 ),
    .\03_array (\03_array_ch05 ), .\04_array (\04_array_ch05 ), .\05_array (\05_array_ch05 ),
    .\06_array (\06_array_ch05 ), .\07_array (\07_array_ch05 ), .\08_array (\08_array_ch05 ),
    .\09_array (\09_array_ch05 ), .\10_array (\10_array_ch05 ), .\11_array (\11_array_ch05 ),
    .\12_array (\12_array_ch05 ), .\13_array (\13_array_ch05 ), .\14_array (\14_array_ch05 ),
    .\15_array (\15_array_ch05 ), .\16_array (\16_array_ch05 ), .\17_array (\17_array_ch05 ),
    .\18_array (\18_array_ch05 ), .\19_array (\19_array_ch05 ), .\20_array (\20_array_ch05 ),
    .\21_array (\21_array_ch05 ), .\22_array (\22_array_ch05 ), .\23_array (\23_array_ch05 ),
    .\24_array (\24_array_ch05 ), .\25_array (\25_array_ch05 ), .\26_array (\26_array_ch05 ),
    .\27_array (\27_array_ch05 ), .\28_array (\28_array_ch05 ), .\29_array (\29_array_ch05 ),
    .\30_array (\30_array_ch05 ), .\31_array (\31_array_ch05 ), .\32_array (\32_array_ch05 ),
    .\33_array (\33_array_ch05 ), .\34_array (\34_array_ch05 ), .\35_array (\35_array_ch05 ),
    .\36_array (\36_array_ch05 ), .\37_array (\37_array_ch05 ));
  mapping inst16 (
    .fiber(fiber), .fxchx(fxch06), .reset(reset), .clock(clock), .array_header(array_header_ch06),
    .\00_array (\00_array_ch06 ), .\01_array (\01_array_ch06 ), .\02_array (\02_array_ch06 ),
    .\03_array (\03_array_ch06 ), .\04_array (\04_array_ch06 ), .\05_array (\05_array_ch06 ),
    .\06_array (\06_array_ch06 ), .\07_array (\07_array_ch06 ), .\08_array (\08_array_ch06 ),
    .\09_array (\09_array_ch06 ), .\10_array (\10_array_ch06 ), .\11_array (\11_array_ch06 ),
    .\12_array (\12_array_ch06 ), .\13_array (\13_array_ch06 ), .\14_array (\14_array_ch06 ),
    .\15_array (\15_array_ch06 ), .\16_array (\16_array_ch06 ), .\17_array (\17_array_ch06 ),
    .\18_array (\18_array_ch06 ), .\19_array (\19_array_ch06 ), .\20_array (\20_array_ch06 ),
    .\21_array (\21_array_ch06 ), .\22_array (\22_array_ch06 ), .\23_array (\23_array_ch06 ),
    .\24_array (\24_array_ch06 ), .\25_array (\25_array_ch06 ), .\26_array (\26_array_ch06 ),
    .\27_array (\27_array_ch06 ), .\28_array (\28_array_ch06 ), .\29_array (\29_array_ch06 ),
    .\30_array (\30_array_ch06 ), .\31_array (\31_array_ch06 ), .\32_array (\32_array_ch06 ),
    .\33_array (\33_array_ch06 ), .\34_array (\34_array_ch06 ), .\35_array (\35_array_ch06 ),
    .\36_array (\36_array_ch06 ), .\37_array (\37_array_ch06 ));
  mapping inst17 (
    .fiber(fiber), .fxchx(fxch07), .reset(reset), .clock(clock), .array_header(array_header_ch07),
    .\00_array (\00_array_ch07 ), .\01_array (\01_array_ch07 ), .\02_array (\02_array_ch07 ),
    .\03_array (\03_array_ch07 ), .\04_array (\04_array_ch07 ), .\05_array (\05_array_ch07 ),
    .\06_array (\06_array_ch07 ), .\07_array (\07_array_ch07 ), .\08_array (\08_array_ch07 ),
    .\09_array (\09_array_ch07 ), .\10_array (\10_array_ch07 ), .\11_array (\11_array_ch07 ),
    .\12_array (\12_array_ch07 ), .\13_array (\13_array_ch07 ), .\14_array (\14_array_ch07 ),
    .\15_array (\15_array_ch07 ), .\16_array (\16_array_ch07 ), .\17_array (\17_array_ch07 ),
    .\18_array (\18_array_ch07 ), .\19_array (\19_array_ch07 ), .\20_array (\20_array_ch07 ),
    .\21_array (\21_array_ch07 ), .\22_array (\22_array_ch07 ), .\23_array (\23_array_ch07 ),
    .\24_array (\24_array_ch07 ), .\25_array (\25_array_ch07 ), .\26_array (\26_array_ch07 ),
    .\27_array (\27_array_ch07 ), .\28_array (\28_array_ch07 ), .\29_array (\29_array_ch07 ),
    .\30_array (\30_array_ch07 ), .\31_array (\31_array_ch07 ), .\32_array (\32_array_ch07 ),
    .\33_array (\33_array_ch07 ), .\34_array (\34_array_ch07 ), .\35_array (\35_array_ch07 ),
    .\36_array (\36_array_ch07 ), .\37_array (\37_array_ch07 ));
  mapping inst18 (
    .fiber(fiber), .fxchx(fxch08), .reset(reset), .clock(clock), .array_header(array_header_ch08),
    .\00_array (\00_array_ch08 ), .\01_array (\01_array_ch08 ), .\02_array (\02_array_ch08 ),
    .\03_array (\03_array_ch08 ), .\04_array (\04_array_ch08 ), .\05_array (\05_array_ch08 ),
    .\06_array (\06_array_ch08 ), .\07_array (\07_array_ch08 ), .\08_array (\08_array_ch08 ),
    .\09_array (\09_array_ch08 ), .\10_array (\10_array_ch08 ), .\11_array (\11_array_ch08 ),
    .\12_array (\12_array_ch08 ), .\13_array (\13_array_ch08 ), .\14_array (\14_array_ch08 ),
    .\15_array (\15_array_ch08 ), .\16_array (\16_array_ch08 ), .\17_array (\17_array_ch08 ),
    .\18_array (\18_array_ch08 ), .\19_array (\19_array_ch08 ), .\20_array (\20_array_ch08 ),
    .\21_array (\21_array_ch08 ), .\22_array (\22_array_ch08 ), .\23_array (\23_array_ch08 ),
    .\24_array (\24_array_ch08 ), .\25_array (\25_array_ch08 ), .\26_array (\26_array_ch08 ),
    .\27_array (\27_array_ch08 ), .\28_array (\28_array_ch08 ), .\29_array (\29_array_ch08 ),
    .\30_array (\30_array_ch08 ), .\31_array (\31_array_ch08 ), .\32_array (\32_array_ch08 ),
    .\33_array (\33_array_ch08 ), .\34_array (\34_array_ch08 ), .\35_array (\35_array_ch08 ),
    .\36_array (\36_array_ch08 ), .\37_array (\37_array_ch08 ));
  mapping inst19 (
    .fiber(fiber), .fxchx(fxch09), .reset(reset), .clock(clock), .array_header(array_header_ch09),
    .\00_array (\00_array_ch09 ), .\01_array (\01_array_ch09 ), .\02_array (\02_array_ch09 ),
    .\03_array (\03_array_ch09 ), .\04_array (\04_array_ch09 ), .\05_array (\05_array_ch09 ),
    .\06_array (\06_array_ch09 ), .\07_array (\07_array_ch09 ), .\08_array (\08_array_ch09 ),
    .\09_array (\09_array_ch09 ), .\10_array (\10_array_ch09 ), .\11_array (\11_array_ch09 ),
    .\12_array (\12_array_ch09 ), .\13_array (\13_array_ch09 ), .\14_array (\14_array_ch09 ),
    .\15_array (\15_array_ch09 ), .\16_array (\16_array_ch09 ), .\17_array (\17_array_ch09 ),
    .\18_array (\18_array_ch09 ), .\19_array (\19_array_ch09 ), .\20_array (\20_array_ch09 ),
    .\21_array (\21_array_ch09 ), .\22_array (\22_array_ch09 ), .\23_array (\23_array_ch09 ),
    .\24_array (\24_array_ch09 ), .\25_array (\25_array_ch09 ), .\26_array (\26_array_ch09 ),
    .\27_array (\27_array_ch09 ), .\28_array (\28_array_ch09 ), .\29_array (\29_array_ch09 ),
    .\30_array (\30_array_ch09 ), .\31_array (\31_array_ch09 ), .\32_array (\32_array_ch09 ),
    .\33_array (\33_array_ch09 ), .\34_array (\34_array_ch09 ), .\35_array (\35_array_ch09 ),
    .\36_array (\36_array_ch09 ), .\37_array (\37_array_ch09 ));
  mapping inst20 (
    .fiber(fiber), .fxchx(fxch10), .reset(reset), .clock(clock), .array_header(array_header_ch10),
    .\00_array (\00_array_ch10 ), .\01_array (\01_array_ch10 ), .\02_array (\02_array_ch10 ),
    .\03_array (\03_array_ch10 ), .\04_array (\04_array_ch10 ), .\05_array (\05_array_ch10 ),
    .\06_array (\06_array_ch10 ), .\07_array (\07_array_ch10 ), .\08_array (\08_array_ch10 ),
    .\09_array (\09_array_ch10 ), .\10_array (\10_array_ch10 ), .\11_array (\11_array_ch10 ),
    .\12_array (\12_array_ch10 ), .\13_array (\13_array_ch10 ), .\14_array (\14_array_ch10 ),
    .\15_array (\15_array_ch10 ), .\16_array (\16_array_ch10 ), .\17_array (\17_array_ch10 ),
    .\18_array (\18_array_ch10 ), .\19_array (\19_array_ch10 ), .\20_array (\20_array_ch10 ),
    .\21_array (\21_array_ch10 ), .\22_array (\22_array_ch10 ), .\23_array (\23_array_ch10 ),
    .\24_array (\24_array_ch10 ), .\25_array (\25_array_ch10 ), .\26_array (\26_array_ch10 ),
    .\27_array (\27_array_ch10 ), .\28_array (\28_array_ch10 ), .\29_array (\29_array_ch10 ),
    .\30_array (\30_array_ch10 ), .\31_array (\31_array_ch10 ), .\32_array (\32_array_ch10 ),
    .\33_array (\33_array_ch10 ), .\34_array (\34_array_ch10 ), .\35_array (\35_array_ch10 ),
    .\36_array (\36_array_ch10 ), .\37_array (\37_array_ch10 ));
  mapping inst21 (
    .fiber(fiber), .fxchx(fxch11), .reset(reset), .clock(clock), .array_header(array_header_ch11),
    .\00_array (\00_array_ch11 ), .\01_array (\01_array_ch11 ), .\02_array (\02_array_ch11 ),
    .\03_array (\03_array_ch11 ), .\04_array (\04_array_ch11 ), .\05_array (\05_array_ch11 ),
    .\06_array (\06_array_ch11 ), .\07_array (\07_array_ch11 ), .\08_array (\08_array_ch11 ),
    .\09_array (\09_array_ch11 ), .\10_array (\10_array_ch11 ), .\11_array (\11_array_ch11 ),
    .\12_array (\12_array_ch11 ), .\13_array (\13_array_ch11 ), .\14_array (\14_array_ch11 ),
    .\15_array (\15_array_ch11 ), .\16_array (\16_array_ch11 ), .\17_array (\17_array_ch11 ),
    .\18_array (\18_array_ch11 ), .\19_array (\19_array_ch11 ), .\20_array (\20_array_ch11 ),
    .\21_array (\21_array_ch11 ), .\22_array (\22_array_ch11 ), .\23_array (\23_array_ch11 ),
    .\24_array (\24_array_ch11 ), .\25_array (\25_array_ch11 ), .\26_array (\26_array_ch11 ),
    .\27_array (\27_array_ch11 ), .\28_array (\28_array_ch11 ), .\29_array (\29_array_ch11 ),
    .\30_array (\30_array_ch11 ), .\31_array (\31_array_ch11 ), .\32_array (\32_array_ch11 ),
    .\33_array (\33_array_ch11 ), .\34_array (\34_array_ch11 ), .\35_array (\35_array_ch11 ),
    .\36_array (\36_array_ch11 ), .\37_array (\37_array_ch11 ));
  mapping inst22 (
    .fiber(fiber), .fxchx(fxch12), .reset(reset), .clock(clock), .array_header(array_header_ch12),
    .\00_array (\00_array_ch12 ), .\01_array (\01_array_ch12 ), .\02_array (\02_array_ch12 ),
    .\03_array (\03_array_ch12 ), .\04_array (\04_array_ch12 ), .\05_array (\05_array_ch12 ),
    .\06_array (\06_array_ch12 ), .\07_array (\07_array_ch12 ), .\08_array (\08_array_ch12 ),
    .\09_array (\09_array_ch12 ), .\10_array (\10_array_ch12 ), .\11_array (\11_array_ch12 ),
    .\12_array (\12_array_ch12 ), .\13_array (\13_array_ch12 ), .\14_array (\14_array_ch12 ),
    .\15_array (\15_array_ch12 ), .\16_array (\16_array_ch12 ), .\17_array (\17_array_ch12 ),
    .\18_array (\18_array_ch12 ), .\19_array (\19_array_ch12 ), .\20_array (\20_array_ch12 ),
    .\21_array (\21_array_ch12 ), .\22_array (\22_array_ch12 ), .\23_array (\23_array_ch12 ),
    .\24_array (\24_array_ch12 ), .\25_array (\25_array_ch12 ), .\26_array (\26_array_ch12 ),
    .\27_array (\27_array_ch12 ), .\28_array (\28_array_ch12 ), .\29_array (\29_array_ch12 ),
    .\30_array (\30_array_ch12 ), .\31_array (\31_array_ch12 ), .\32_array (\32_array_ch12 ),
    .\33_array (\33_array_ch12 ), .\34_array (\34_array_ch12 ), .\35_array (\35_array_ch12 ),
    .\36_array (\36_array_ch12 ), .\37_array (\37_array_ch12 ));
  mapping inst23 (
    .fiber(fiber), .fxchx(fxch13), .reset(reset), .clock(clock), .array_header(array_header_ch13),
    .\00_array (\00_array_ch13 ), .\01_array (\01_array_ch13 ), .\02_array (\02_array_ch13 ),
    .\03_array (\03_array_ch13 ), .\04_array (\04_array_ch13 ), .\05_array (\05_array_ch13 ),
    .\06_array (\06_array_ch13 ), .\07_array (\07_array_ch13 ), .\08_array (\08_array_ch13 ),
    .\09_array (\09_array_ch13 ), .\10_array (\10_array_ch13 ), .\11_array (\11_array_ch13 ),
    .\12_array (\12_array_ch13 ), .\13_array (\13_array_ch13 ), .\14_array (\14_array_ch13 ),
    .\15_array (\15_array_ch13 ), .\16_array (\16_array_ch13 ), .\17_array (\17_array_ch13 ),
    .\18_array (\18_array_ch13 ), .\19_array (\19_array_ch13 ), .\20_array (\20_array_ch13 ),
    .\21_array (\21_array_ch13 ), .\22_array (\22_array_ch13 ), .\23_array (\23_array_ch13 ),
    .\24_array (\24_array_ch13 ), .\25_array (\25_array_ch13 ), .\26_array (\26_array_ch13 ),
    .\27_array (\27_array_ch13 ), .\28_array (\28_array_ch13 ), .\29_array (\29_array_ch13 ),
    .\30_array (\30_array_ch13 ), .\31_array (\31_array_ch13 ), .\32_array (\32_array_ch13 ),
    .\33_array (\33_array_ch13 ), .\34_array (\34_array_ch13 ), .\35_array (\35_array_ch13 ),
    .\36_array (\36_array_ch13 ), .\37_array (\37_array_ch13 ));
  mapping inst24 (
    .fiber(fiber), .fxchx(fxch14), .reset(reset), .clock(clock), .array_header(array_header),
    .\00_array (\00_array_ch14 ), .\01_array (\01_array_ch14 ), .\02_array (\02_array_ch14 ),
    .\03_array (\03_array_ch14 ), .\04_array (\04_array_ch14 ), .\05_array (\05_array_ch14 ),
    .\06_array (\06_array_ch14 ), .\07_array (\07_array_ch14 ), .\08_array (\08_array_ch14 ),
    .\09_array (\09_array_ch14 ), .\10_array (\10_array_ch14 ), .\11_array (\11_array_ch14 ),
    .\12_array (\12_array_ch14 ), .\13_array (\13_array_ch14 ), .\14_array (\14_array_ch14 ),
    .\15_array (\15_array_ch14 ), .\16_array (\16_array_ch14 ), .\17_array (\17_array_ch14 ),
    .\18_array (\18_array_ch14 ), .\19_array (\19_array_ch14 ), .\20_array (\20_array_ch14 ),
    .\21_array (\21_array_ch14 ), .\22_array (\22_array_ch14 ), .\23_array (\23_array_ch14 ),
    .\24_array (\24_array_ch14 ), .\25_array (\25_array_ch14 ), .\26_array (\26_array_ch14 ),
    .\27_array (\27_array_ch14 ), .\28_array (\28_array_ch14 ), .\29_array (\29_array_ch14 ),
    .\30_array (\30_array_ch14 ), .\31_array (\31_array_ch14 ), .\32_array (\32_array_ch14 ),
    .\33_array (\33_array_ch14 ), .\34_array (\34_array_ch14 ), .\35_array (\35_array_ch14 ),
    .\36_array (\36_array_ch14 ), .\37_array (\37_array_ch14 ));
  mapping inst25 (
    .fiber(fiber), .fxchx(fxch15), .reset(reset), .clock(clock), .array_header(array_header_ch15),
    .\00_array (\00_array_ch15 ), .\01_array (\01_array_ch15 ), .\02_array (\02_array_ch15 ),
    .\03_array (\03_array_ch15 ), .\04_array (\04_array_ch15 ), .\05_array (\05_array_ch15 ),
    .\06_array (\06_array_ch15 ), .\07_array (\07_array_ch15 ), .\08_array (\08_array_ch15 ),
    .\09_array (\09_array_ch15 ), .\10_array (\10_array_ch15 ), .\11_array (\11_array_ch15 ),
    .\12_array (\12_array_ch15 ), .\13_array (\13_array_ch15 ), .\14_array (\14_array_ch15 ),
    .\15_array (\15_array_ch15 ), .\16_array (\16_array_ch15 ), .\17_array (\17_array_ch15 ),
    .\18_array (\18_array_ch15 ), .\19_array (\19_array_ch15 ), .\20_array (\20_array_ch15 ),
    .\21_array (\21_array_ch15 ), .\22_array (\22_array_ch15 ), .\23_array (\23_array_ch15 ),
    .\24_array (\24_array_ch15 ), .\25_array (\25_array_ch15 ), .\26_array (\26_array_ch15 ),
    .\27_array (\27_array_ch15 ), .\28_array (\28_array_ch15 ), .\29_array (\29_array_ch15 ),
    .\30_array (\30_array_ch15 ), .\31_array (\31_array_ch15 ), .\32_array (\32_array_ch15 ),
    .\33_array (\33_array_ch15 ), .\34_array (\34_array_ch15 ), .\35_array (\35_array_ch15 ),
    .\36_array (\36_array_ch15 ), .\37_array (\37_array_ch15 ));
  mapping_or38b_16 inst26 (
    .data0x(\00_array_ch00 ), .data1x(\00_array_ch01 ), .data2x(\00_array_ch02 ), .data3x(\00_array_ch03 ),
    .data4x(\00_array_ch04 ), .data5x(\00_array_ch05 ), .data6x(\00_array_ch06 ), .data7x(\00_array_ch07 ),
    .data8x(\00_array_ch08 ), .data9x(\00_array_ch09 ), .data10x(\00_array_ch10 ), .data11x(\00_array_ch11 ),
    .data12x(\00_array_ch12 ), .data13x(\00_array_ch13 ), .data14x(\00_array_ch14 ),
    .data15x(\00_array_ch15 ), .result(\00_array_sum ));
  mapping_or38b_16 inst27 (
    .data0x(\01_array_ch00 ), .data1x(\01_array_ch01 ), .data2x(\01_array_ch02 ), .data3x(\01_array_ch03 ),
    .data4x(\01_array_ch04 ), .data5x(\01_array_ch05 ), .data6x(\01_array_ch06 ), .data7x(\01_array_ch07 ),
    .data8x(\01_array_ch08 ), .data9x(\01_array_ch09 ), .data10x(\01_array_ch10 ), .data11x(\01_array_ch11 ),
    .data12x(\01_array_ch12 ), .data13x(\01_array_ch13 ), .data14x(\01_array_ch14 ),
    .data15x(\01_array_ch15 ), .result(\01_array_sum ));
  mapping_or38b_16 inst28 (
    .data0x(\02_array_ch00 ), .data1x(\02_array_ch01 ), .data2x(\02_array_ch02 ), .data3x(\02_array_ch03 ),
    .data4x(\02_array_ch04 ), .data5x(\02_array_ch05 ), .data6x(\02_array_ch06 ), .data7x(\02_array_ch07 ),
    .data8x(\02_array_ch08 ), .data9x(\02_array_ch09 ), .data10x(\02_array_ch10 ), .data11x(\02_array_ch11 ),
    .data12x(\02_array_ch12 ), .data13x(\02_array_ch13 ), .data14x(\02_array_ch14 ),
    .data15x(\02_array_ch15 ), .result(\02_array_sum ));
  mapping_or38b_16 inst29 (
    .data0x(\03_array_ch00 ), .data1x(\03_array_ch01 ), .data2x(\03_array_ch02 ), .data3x(\03_array_ch03 ),
    .data4x(\03_array_ch04 ), .data5x(\03_array_ch05 ), .data6x(\03_array_ch06 ), .data7x(\03_array_ch07 ),
    .data8x(\03_array_ch08 ), .data9x(\03_array_ch09 ), .data10x(\03_array_ch10 ), .data11x(\03_array_ch11 ),
    .data12x(\03_array_ch12 ), .data13x(\03_array_ch13 ), .data14x(\03_array_ch14 ),
    .data15x(\03_array_ch15 ), .result(\03_array_sum ));
  mapping_or38b_16 inst30 (
    .data0x(\04_array_ch00 ), .data1x(\04_array_ch01 ), .data2x(\04_array_ch02 ), .data3x(\04_array_ch03 ),
    .data4x(\04_array_ch04 ), .data5x(\04_array_ch05 ), .data6x(\04_array_ch06 ), .data7x(\04_array_ch07 ),
    .data8x(\04_array_ch08 ), .data9x(\04_array_ch09 ), .data10x(\04_array_ch10 ), .data11x(\04_array_ch11 ),
    .data12x(\04_array_ch12 ), .data13x(\04_array_ch13 ), .data14x(\04_array_ch14 ),
    .data15x(\04_array_ch15 ), .result(\04_array_sum ));
  mapping_or38b_16 inst31 (
    .data0x(\05_array_ch00 ), .data1x(\05_array_ch01 ), .data2x(\05_array_ch02 ), .data3x(\05_array_ch03 ),
    .data4x(\05_array_ch04 ), .data5x(\05_array_ch05 ), .data6x(\05_array_ch06 ), .data7x(\05_array_ch07 ),
    .data8x(\05_array_ch08 ), .data9x(\05_array_ch09 ), .data10x(\05_array_ch10 ), .data11x(\05_array_ch11 ),
    .data12x(\05_array_ch12 ), .data13x(\05_array_ch13 ), .data14x(\05_array_ch14 ),
    .data15x(\05_array_ch15 ), .result(\05_array_sum ));
  mapping_or38b_16 inst32 (
    .data0x(\06_array_ch00 ), .data1x(\06_array_ch01 ), .data2x(\06_array_ch02 ), .data3x(\06_array_ch03 ),
    .data4x(\06_array_ch04 ), .data5x(\06_array_ch05 ), .data6x(\06_array_ch06 ), .data7x(\06_array_ch07 ),
    .data8x(\06_array_ch08 ), .data9x(\06_array_ch09 ), .data10x(\06_array_ch10 ), .data11x(\06_array_ch11 ),
    .data12x(\06_array_ch12 ), .data13x(\06_array_ch13 ), .data14x(\06_array_ch14 ),
    .data15x(\06_array_ch15 ), .result(\06_array_sum ));
  mapping_or38b_16 inst33 (
    .data0x(\07_array_ch00 ), .data1x(\07_array_ch01 ), .data2x(\07_array_ch02 ), .data3x(\07_array_ch03 ),
    .data4x(\07_array_ch04 ), .data5x(\07_array_ch05 ), .data6x(\07_array_ch06 ), .data7x(\07_array_ch07 ),
    .data8x(\07_array_ch08 ), .data9x(\07_array_ch09 ), .data10x(\07_array_ch10 ), .data11x(\07_array_ch11 ),
    .data12x(\07_array_ch12 ), .data13x(\07_array_ch13 ), .data14x(\07_array_ch14 ),
    .data15x(\07_array_ch15 ), .result(\07_array_sum ));
  mapping_or38b_16 inst34 (
    .data0x(\08_array_ch00 ), .data1x(\08_array_ch01 ), .data2x(\08_array_ch02 ), .data3x(\08_array_ch03 ),
    .data4x(\08_array_ch04 ), .data5x(\08_array_ch05 ), .data6x(\08_array_ch06 ), .data7x(\08_array_ch07 ),
    .data8x(\08_array_ch08 ), .data9x(\08_array_ch09 ), .data10x(\08_array_ch10 ), .data11x(\08_array_ch11 ),
    .data12x(\08_array_ch12 ), .data13x(\08_array_ch13 ), .data14x(\08_array_ch14 ),
    .data15x(\08_array_ch15 ), .result(\08_array_sum ));
  mapping_or38b_16 inst35 (
    .data0x(\09_array_ch00 ), .data1x(\09_array_ch01 ), .data2x(\09_array_ch02 ), .data3x(\09_array_ch03 ),
    .data4x(\09_array_ch04 ), .data5x(\09_array_ch05 ), .data6x(\09_array_ch06 ), .data7x(\09_array_ch07 ),
    .data8x(\09_array_ch08 ), .data9x(\09_array_ch09 ), .data10x(\09_array_ch10 ), .data11x(\09_array_ch11 ),
    .data12x(\09_array_ch12 ), .data13x(\09_array_ch13 ), .data14x(\09_array_ch14 ),
    .data15x(\09_array_ch15 ), .result(\09_array_sum ));
  mapping_or38b_16 inst36 (
    .data0x(\10_array_ch00 ), .data1x(\10_array_ch01 ), .data2x(\10_array_ch02 ), .data3x(\10_array_ch03 ),
    .data4x(\10_array_ch04 ), .data5x(\10_array_ch05 ), .data6x(\10_array_ch06 ), .data7x(\10_array_ch07 ),
    .data8x(\10_array_ch08 ), .data9x(\10_array_ch09 ), .data10x(\10_array_ch10 ), .data11x(\10_array_ch11 ),
    .data12x(\10_array_ch12 ), .data13x(\10_array_ch13 ), .data14x(\10_array_ch14 ),
    .data15x(\10_array_ch15 ), .result(\10_array_sum ));
  mapping_or38b_16 inst37 (
    .data0x(\11_array_ch00 ), .data1x(\11_array_ch01 ), .data2x(\11_array_ch02 ), .data3x(\11_array_ch03 ),
    .data4x(\11_array_ch04 ), .data5x(\11_array_ch05 ), .data6x(\11_array_ch06 ), .data7x(\11_array_ch07 ),
    .data8x(\11_array_ch08 ), .data9x(\11_array_ch09 ), .data10x(\11_array_ch10 ), .data11x(\11_array_ch11 ),
    .data12x(\11_array_ch12 ), .data13x(\11_array_ch13 ), .data14x(\11_array_ch14 ),
    .data15x(\11_array_ch15 ), .result(\11_array_sum ));
  mapping_or38b_16 inst38 (
    .data0x(\12_array_ch00 ), .data1x(\12_array_ch01 ), .data2x(\12_array_ch02 ), .data3x(\12_array_ch03 ),
    .data4x(\12_array_ch04 ), .data5x(\12_array_ch05 ), .data6x(\12_array_ch06 ), .data7x(\12_array_ch07 ),
    .data8x(\12_array_ch08 ), .data9x(\12_array_ch09 ), .data10x(\12_array_ch10 ), .data11x(\12_array_ch11 ),
    .data12x(\12_array_ch12 ), .data13x(\12_array_ch13 ), .data14x(\12_array_ch14 ),
    .data15x(\12_array_ch15 ), .result(\12_array_sum ));
  mapping_or38b_16 inst39 (
    .data0x(\13_array_ch00 ), .data1x(\13_array_ch01 ), .data2x(\13_array_ch02 ), .data3x(\13_array_ch03 ),
    .data4x(\13_array_ch04 ), .data5x(\13_array_ch05 ), .data6x(\13_array_ch06 ), .data7x(\13_array_ch07 ),
    .data8x(\13_array_ch08 ), .data9x(\13_array_ch09 ), .data10x(\13_array_ch10 ), .data11x(\13_array_ch11 ),
    .data12x(\13_array_ch12 ), .data13x(\13_array_ch13 ), .data14x(\13_array_ch14 ),
    .data15x(\13_array_ch15 ), .result(\13_array_sum ));
  mapping_or38b_16 inst40 (
    .data0x(\14_array_ch00 ), .data1x(\14_array_ch01 ), .data2x(\14_array_ch02 ), .data3x(\14_array_ch03 ),
    .data4x(\14_array_ch04 ), .data5x(\14_array_ch05 ), .data6x(\14_array_ch06 ), .data7x(\14_array_ch07 ),
    .data8x(\14_array_ch08 ), .data9x(\14_array_ch09 ), .data10x(\14_array_ch10 ), .data11x(\14_array_ch11 ),
    .data12x(\14_array_ch12 ), .data13x(\14_array_ch13 ), .data14x(\14_array_ch14 ),
    .data15x(\14_array_ch15 ), .result(\14_array_sum ));
  mapping_or38b_16 inst41 (
    .data0x(\15_array_ch00 ), .data1x(\15_array_ch01 ), .data2x(\15_array_ch02 ), .data3x(\15_array_ch03 ),
    .data4x(\15_array_ch04 ), .data5x(\15_array_ch05 ), .data6x(\15_array_ch06 ), .data7x(\15_array_ch07 ),
    .data8x(\15_array_ch08 ), .data9x(\15_array_ch09 ), .data10x(\15_array_ch10 ), .data11x(\15_array_ch11 ),
    .data12x(\15_array_ch12 ), .data13x(\15_array_ch13 ), .data14x(\15_array_ch14 ),
    .data15x(\15_array_ch15 ), .result(\15_array_sum ));
  mapping_or38b_16 inst42 (
    .data0x(\16_array_ch00 ), .data1x(\16_array_ch01 ), .data2x(\16_array_ch02 ), .data3x(\16_array_ch03 ),
    .data4x(\16_array_ch04 ), .data5x(\16_array_ch05 ), .data6x(\16_array_ch06 ), .data7x(\16_array_ch07 ),
    .data8x(\16_array_ch08 ), .data9x(\16_array_ch09 ), .data10x(\16_array_ch10 ), .data11x(\16_array_ch11 ),
    .data12x(\16_array_ch12 ), .data13x(\16_array_ch13 ), .data14x(\16_array_ch14 ),
    .data15x(\16_array_ch15 ), .result(\16_array_sum ));
  mapping_or38b_16 inst43 (
    .data0x(\17_array_ch00 ), .data1x(\17_array_ch01 ), .data2x(\17_array_ch02 ), .data3x(\17_array_ch03 ),
    .data4x(\17_array_ch04 ), .data5x(\17_array_ch05 ), .data6x(\17_array_ch06 ), .data7x(\17_array_ch07 ),
    .data8x(\17_array_ch08 ), .data9x(\17_array_ch09 ), .data10x(\17_array_ch10 ), .data11x(\17_array_ch11 ),
    .data12x(\17_array_ch12 ), .data13x(\17_array_ch13 ), .data14x(\17_array_ch14 ),
    .data15x(\17_array_ch15 ), .result(\17_array_sum ));
  mapping_or38b_16 inst44 (
    .data0x(\18_array_ch00 ), .data1x(\18_array_ch01 ), .data2x(\18_array_ch02 ), .data3x(\18_array_ch03 ),
    .data4x(\18_array_ch04 ), .data5x(\18_array_ch05 ), .data6x(\18_array_ch06 ), .data7x(\18_array_ch07 ),
    .data8x(\18_array_ch08 ), .data9x(\18_array_ch09 ), .data10x(\18_array_ch10 ), .data11x(\18_array_ch11 ),
    .data12x(\18_array_ch12 ), .data13x(\18_array_ch13 ), .data14x(\18_array_ch14 ),
    .data15x(\18_array_ch15 ), .result(\18_array_sum ));
  mapping_or38b_16 inst45 (
    .data0x(\19_array_ch00 ), .data1x(\19_array_ch01 ), .data2x(\19_array_ch02 ), .data3x(\19_array_ch03 ),
    .data4x(\19_array_ch04 ), .data5x(\19_array_ch05 ), .data6x(\19_array_ch06 ), .data7x(\19_array_ch07 ),
    .data8x(\19_array_ch08 ), .data9x(\19_array_ch09 ), .data10x(\19_array_ch10 ), .data11x(\19_array_ch11 ),
    .data12x(\19_array_ch12 ), .data13x(\19_array_ch13 ), .data14x(\19_array_ch14 ),
    .data15x(\19_array_ch15 ), .result(\19_array_sum ));
  mapping_or38b_16 inst46 (
    .data0x(\20_array_ch00 ), .data1x(\20_array_ch01 ), .data2x(\20_array_ch02 ), .data3x(\20_array_ch03 ),
    .data4x(\20_array_ch04 ), .data5x(\20_array_ch05 ), .data6x(\20_array_ch06 ), .data7x(\20_array_ch07 ),
    .data8x(\20_array_ch08 ), .data9x(\20_array_ch09 ), .data10x(\20_array_ch10 ), .data11x(\20_array_ch11 ),
    .data12x(\20_array_ch12 ), .data13x(\20_array_ch13 ), .data14x(\20_array_ch14 ),
    .data15x(\20_array_ch15 ), .result(\20_array_sum ));
  mapping_or38b_16 inst47 (
    .data0x(\21_array_ch00 ), .data1x(\21_array_ch01 ), .data2x(\21_array_ch02 ), .data3x(\21_array_ch03 ),
    .data4x(\21_array_ch04 ), .data5x(\21_array_ch05 ), .data6x(\21_array_ch06 ), .data7x(\21_array_ch07 ),
    .data8x(\21_array_ch08 ), .data9x(\21_array_ch09 ), .data10x(\21_array_ch10 ), .data11x(\21_array_ch11 ),
    .data12x(\21_array_ch12 ), .data13x(\21_array_ch13 ), .data14x(\21_array_ch14 ),
    .data15x(\21_array_ch15 ), .result(\21_array_sum ));
  mapping_or38b_16 inst48 (
    .data0x(\22_array_ch00 ), .data1x(\22_array_ch01 ), .data2x(\22_array_ch02 ), .data3x(\22_array_ch03 ),
    .data4x(\22_array_ch04 ), .data5x(\22_array_ch05 ), .data6x(\22_array_ch06 ), .data7x(\22_array_ch07 ),
    .data8x(\22_array_ch08 ), .data9x(\22_array_ch09 ), .data10x(\22_array_ch10 ), .data11x(\22_array_ch11 ),
    .data12x(\22_array_ch12 ), .data13x(\22_array_ch13 ), .data14x(\22_array_ch14 ),
    .data15x(\22_array_ch15 ), .result(\22_array_sum ));
  mapping_or38b_16 inst49 (
    .data0x(\23_array_ch00 ), .data1x(\23_array_ch01 ), .data2x(\23_array_ch02 ), .data3x(\23_array_ch03 ),
    .data4x(\23_array_ch04 ), .data5x(\23_array_ch05 ), .data6x(\23_array_ch06 ), .data7x(\23_array_ch07 ),
    .data8x(\23_array_ch08 ), .data9x(\23_array_ch09 ), .data10x(\23_array_ch10 ), .data11x(\23_array_ch11 ),
    .data12x(\23_array_ch12 ), .data13x(\23_array_ch13 ), .data14x(\23_array_ch14 ),
    .data15x(\23_array_ch15 ), .result(\23_array_sum ));
  mapping_or38b_16 inst50 (
    .data0x(\24_array_ch00 ), .data1x(\24_array_ch01 ), .data2x(\24_array_ch02 ), .data3x(\24_array_ch03 ),
    .data4x(\24_array_ch04 ), .data5x(\24_array_ch05 ), .data6x(\24_array_ch06 ), .data7x(\24_array_ch07 ),
    .data8x(\24_array_ch08 ), .data9x(\24_array_ch09 ), .data10x(\24_array_ch10 ), .data11x(\24_array_ch11 ),
    .data12x(\24_array_ch12 ), .data13x(\24_array_ch13 ), .data14x(\24_array_ch14 ),
    .data15x(\24_array_ch15 ), .result(\24_array_sum ));
  mapping_or38b_16 inst51 (
    .data0x(\25_array_ch00 ), .data1x(\25_array_ch01 ), .data2x(\25_array_ch02 ), .data3x(\25_array_ch03 ),
    .data4x(\25_array_ch04 ), .data5x(\25_array_ch05 ), .data6x(\25_array_ch06 ), .data7x(\25_array_ch07 ),
    .data8x(\25_array_ch08 ), .data9x(\25_array_ch09 ), .data10x(\25_array_ch10 ), .data11x(\25_array_ch11 ),
    .data12x(\25_array_ch12 ), .data13x(\25_array_ch13 ), .data14x(\25_array_ch14 ),
    .data15x(\25_array_ch15 ), .result(\25_array_sum ));
  mapping_or38b_16 inst52 (
    .data0x(\26_array_ch00 ), .data1x(\26_array_ch01 ), .data2x(\26_array_ch02 ), .data3x(\26_array_ch03 ),
    .data4x(\26_array_ch04 ), .data5x(\26_array_ch05 ), .data6x(\26_array_ch06 ), .data7x(\26_array_ch07 ),
    .data8x(\26_array_ch08 ), .data9x(\26_array_ch09 ), .data10x(\26_array_ch10 ), .data11x(\26_array_ch11 ),
    .data12x(\26_array_ch12 ), .data13x(\26_array_ch13 ), .data14x(\26_array_ch14 ),
    .data15x(\26_array_ch15 ), .result(\26_array_sum ));
  mapping_or38b_16 inst53 (
    .data0x(\27_array_ch00 ), .data1x(\27_array_ch01 ), .data2x(\27_array_ch02 ), .data3x(\27_array_ch03 ),
    .data4x(\27_array_ch04 ), .data5x(\27_array_ch05 ), .data6x(\27_array_ch06 ), .data7x(\27_array_ch07 ),
    .data8x(\27_array_ch08 ), .data9x(\27_array_ch09 ), .data10x(\27_array_ch10 ), .data11x(\27_array_ch11 ),
    .data12x(\27_array_ch12 ), .data13x(\27_array_ch13 ), .data14x(\27_array_ch14 ),
    .data15x(\27_array_ch15 ), .result(\27_array_sum ));
  mapping_or38b_16 inst54 (
    .data0x(\28_array_ch00 ), .data1x(\28_array_ch01 ), .data2x(\28_array_ch02 ), .data3x(\28_array_ch03 ),
    .data4x(\28_array_ch04 ), .data5x(\28_array_ch05 ), .data6x(\28_array_ch06 ), .data7x(\28_array_ch07 ),
    .data8x(\28_array_ch08 ), .data9x(\28_array_ch09 ), .data10x(\28_array_ch10 ), .data11x(\28_array_ch11 ),
    .data12x(\28_array_ch12 ), .data13x(\28_array_ch13 ), .data14x(\28_array_ch14 ),
    .data15x(\28_array_ch15 ), .result(\28_array_sum ));
  mapping_or38b_16 inst55 (
    .data0x(\29_array_ch00 ), .data1x(\29_array_ch01 ), .data2x(\29_array_ch02 ), .data3x(\29_array_ch03 ),
    .data4x(\29_array_ch04 ), .data5x(\29_array_ch05 ), .data6x(\29_array_ch06 ), .data7x(\29_array_ch07 ),
    .data8x(\29_array_ch08 ), .data9x(\29_array_ch09 ), .data10x(\29_array_ch10 ), .data11x(\29_array_ch11 ),
    .data12x(\29_array_ch12 ), .data13x(\29_array_ch13 ), .data14x(\29_array_ch14 ),
    .data15x(\29_array_ch15 ), .result(\29_array_sum ));
